# EasyEDA Pro project 主控板.eprj

# Schematic Schematic1

## Sheets
1 P1: Board Name: Board1; Create Date: 2025-03-21; Page Name: P1; Project Name: G431主控板 (2); Schematic Name: Schematic1; Update Date: 2025-07-14; Company: 嘉立创EDA; Page Size: A4; Version: V1.0
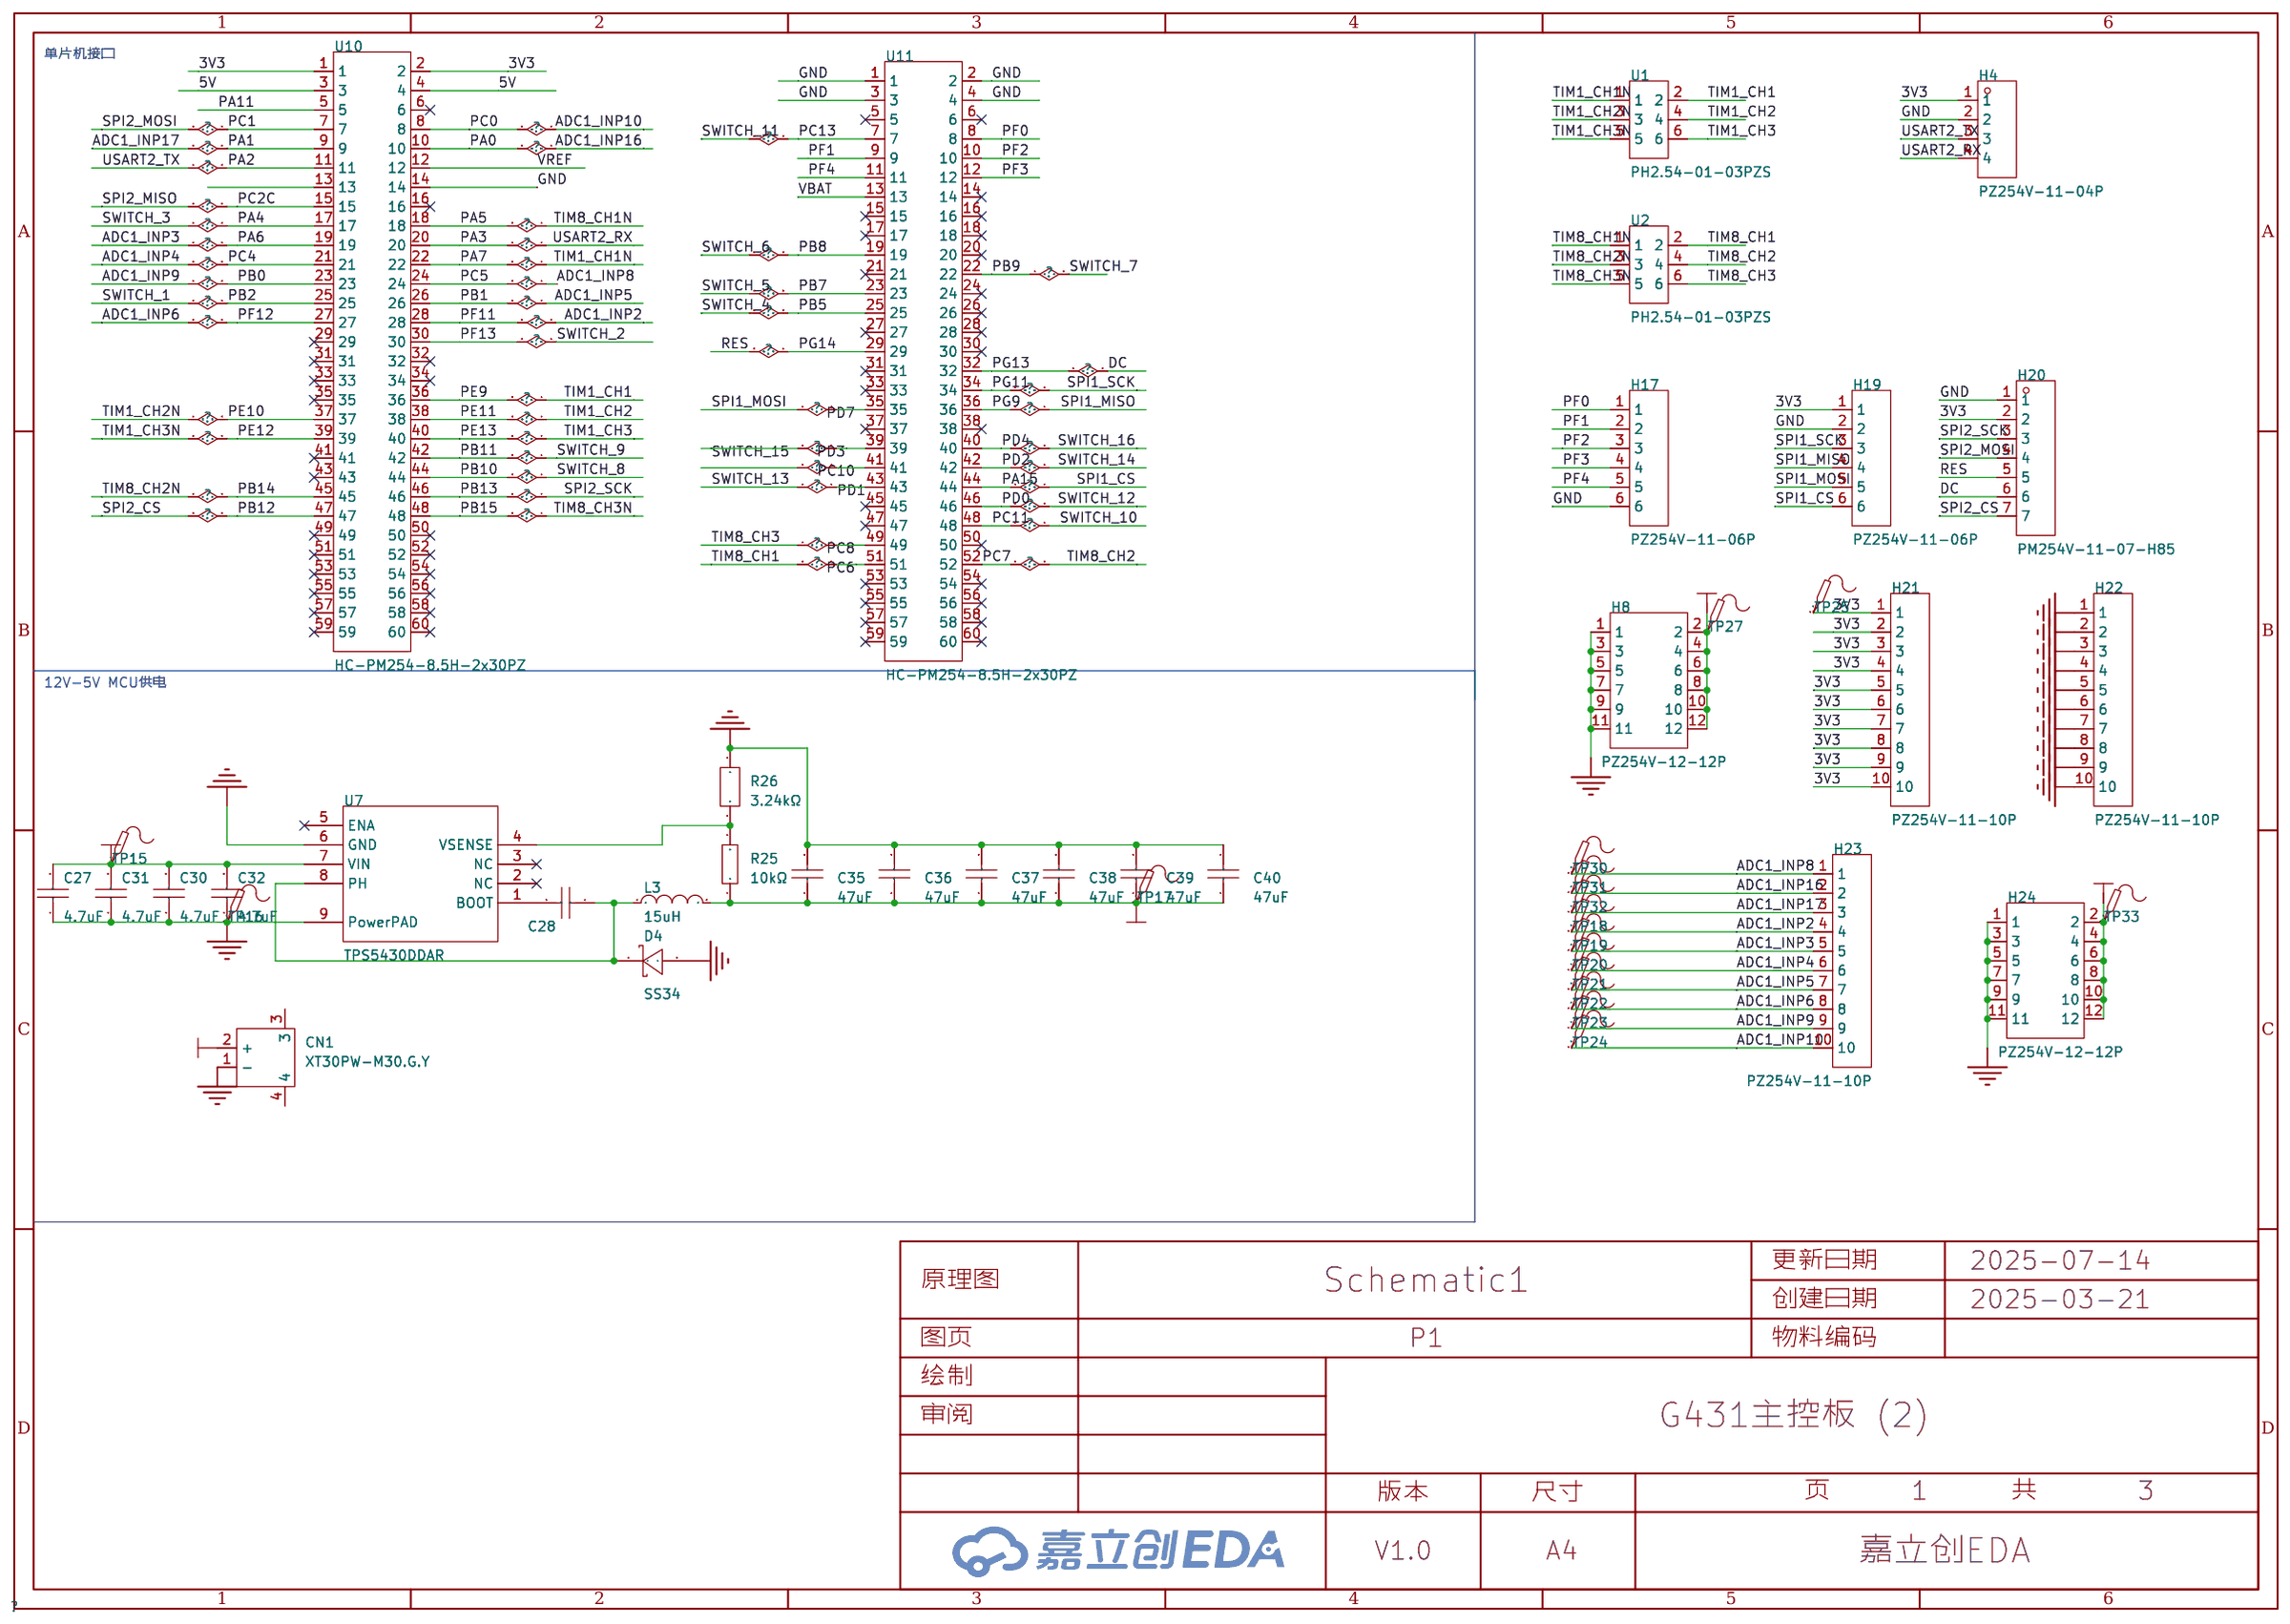
[diagram p0: P1]
2 P2: Create Date: 2025-05-21; Page Name: P2; Project Name: G431主控板; Update Date: 2025-05-21
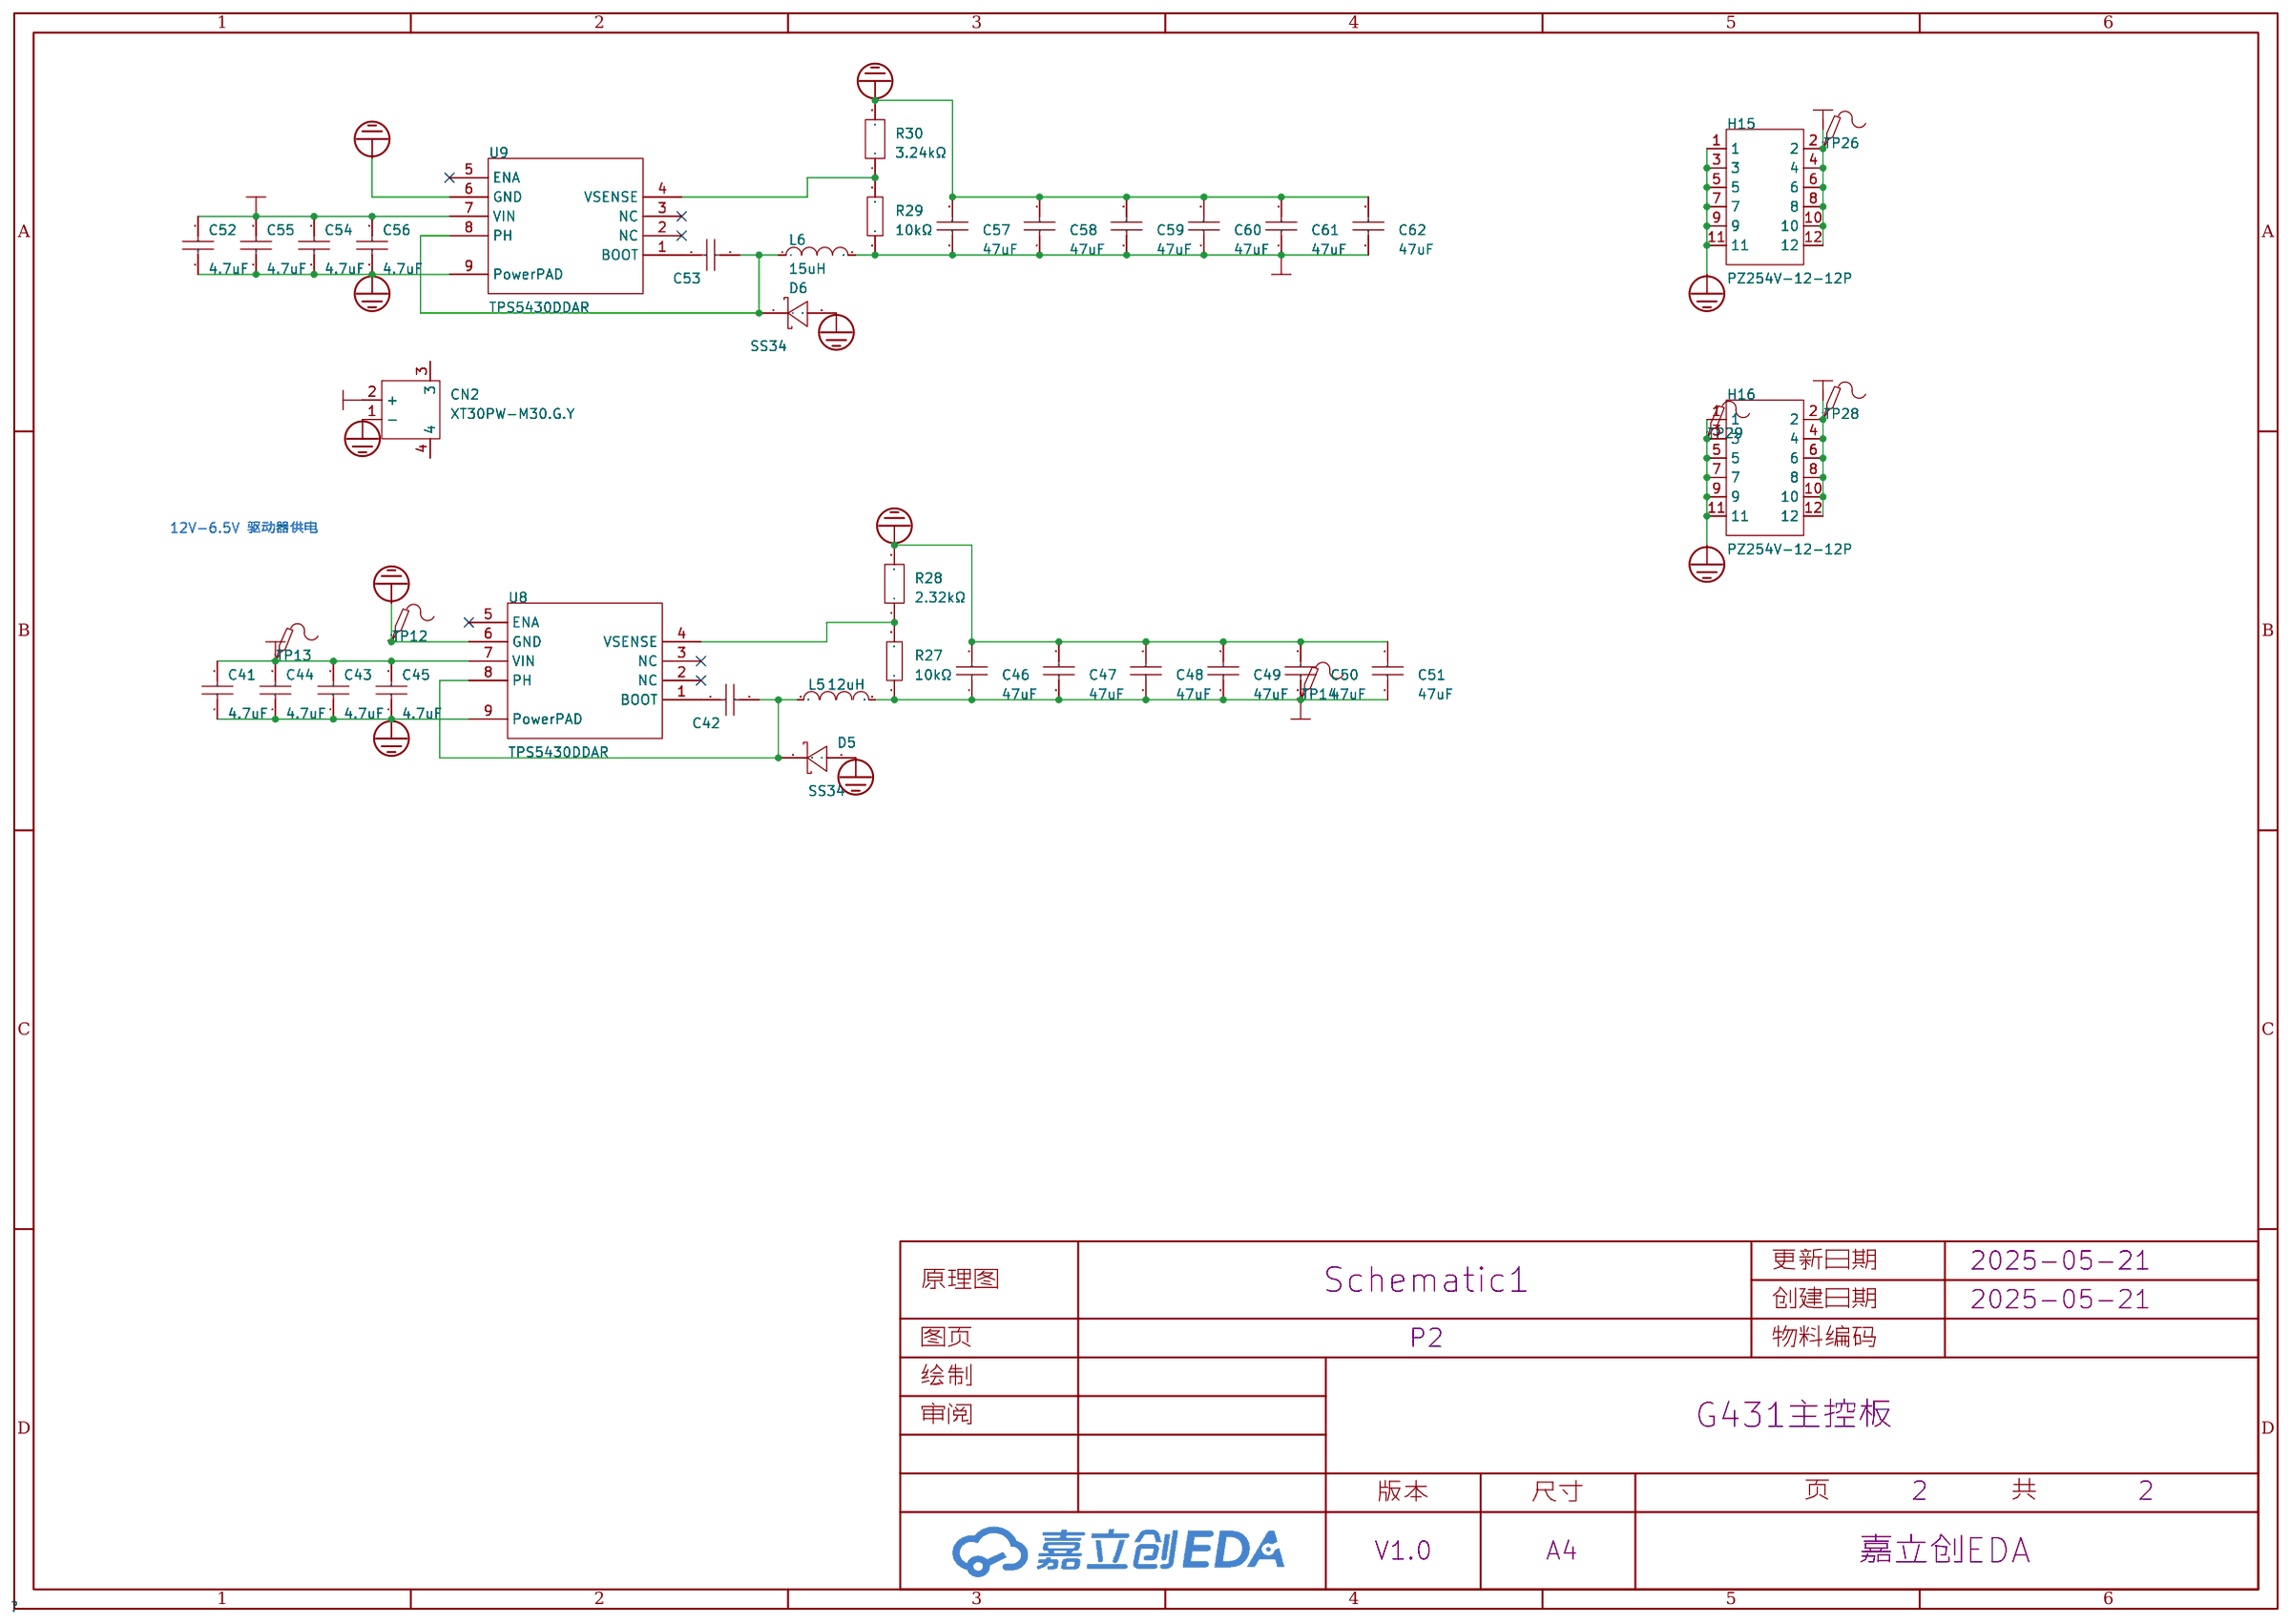
[diagram p1: P2]
3 P3: Create Date: 2025-06-02; Page Name: P3; Project Name: G431主控板; Update Date: 2025-06-02
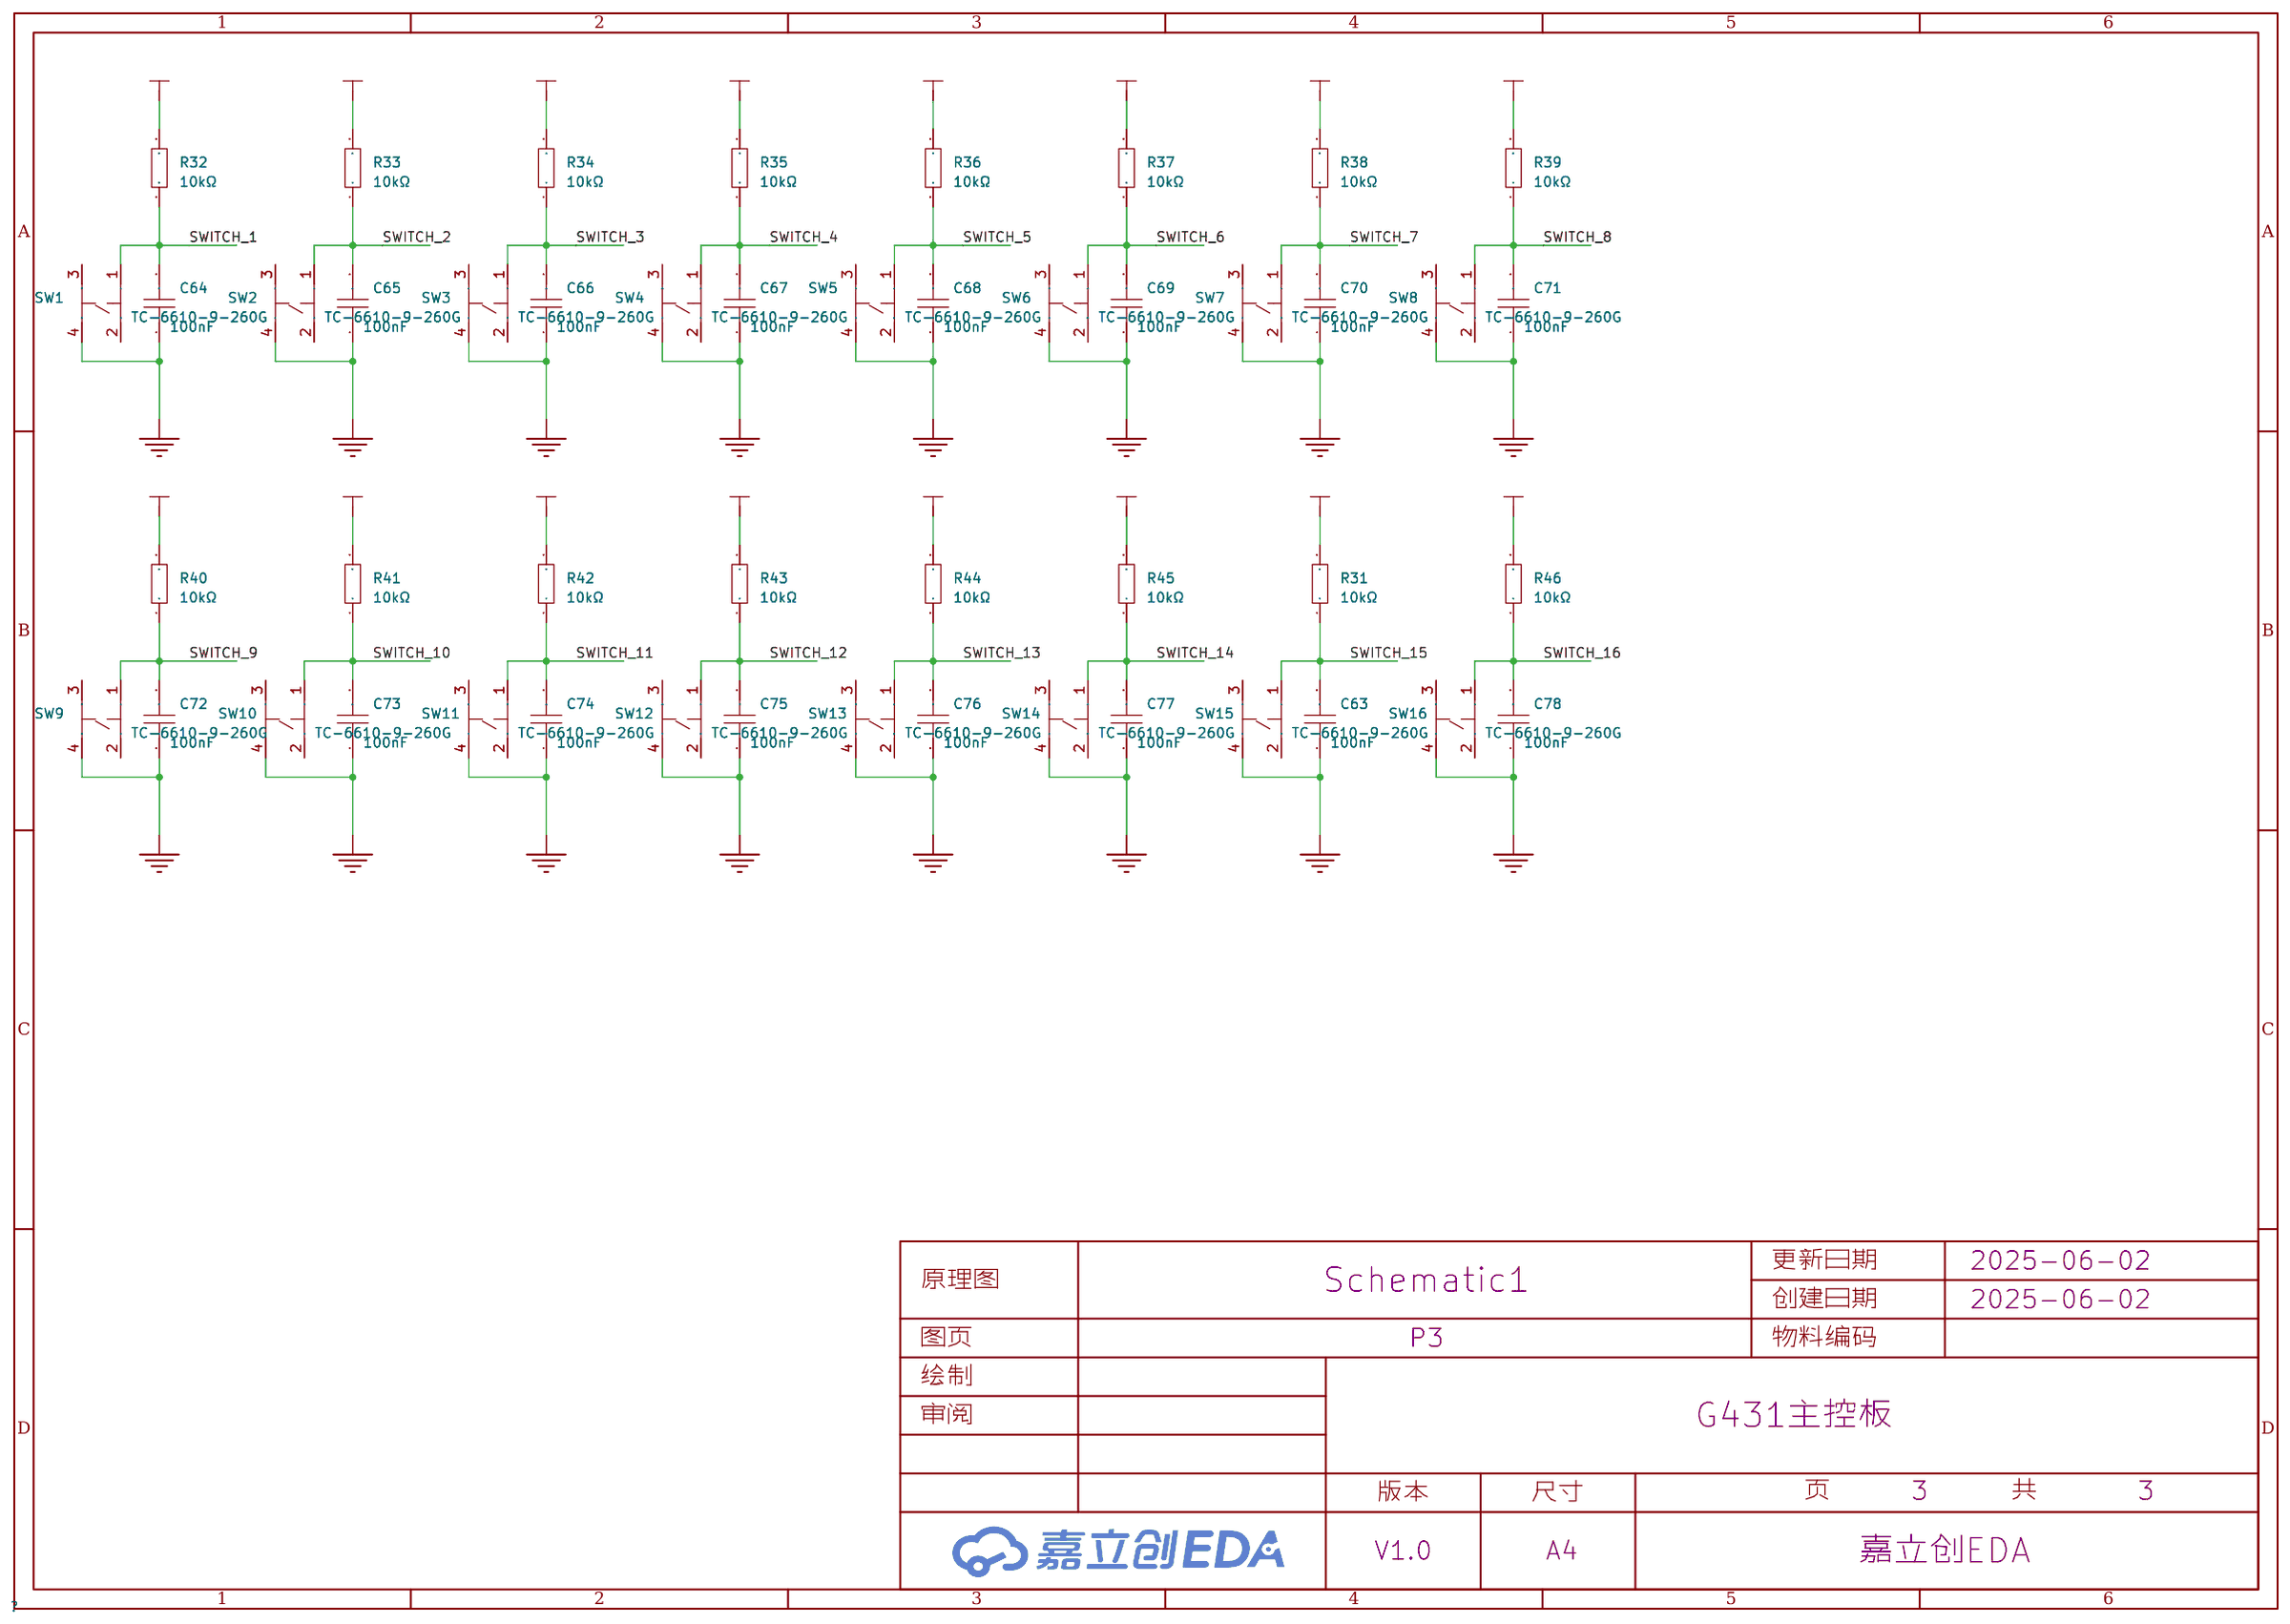
[diagram p2: P3]

## Parts
sheet P1
C27  4.7uF  [C0603]
C28  10nF  [C0603]
C30  4.7uF  [C0603]
C31  4.7uF  [C0603]
C32  4.7uF  [C0603]
C35  47uF  [C0805]
C36  47uF  [C0805]
C37  47uF  [C0805]
C38  47uF  [C0805]
C39  47uF  [C0805]
C40  47uF  [C0805]
CN1  XT30PW-M30.G.Y  [CONN-TH_XT30PW-M]
D4  SS34  [SMA_L4.3-W2.6-LS5.2-RD]
H4  PZ254V-11-04P  [HDR-TH_4P-P2.54-V-M]
H8  PZ254V-12-12P  [HDR-TH_12P-P2.54-V-M-R2-C6-S2.54]
H17  PZ254V-11-06P  [HDR-TH_6P-P2.54-V-M]
H19  PZ254V-11-06P  [HDR-TH_6P-P2.54-V-M]
H20  PM254V-11-07-H85  [HDR-TH_7P-P2.54-V-F]
H21  PZ254V-11-10P  [HDR-TH_10P-P2.54-V-M]
H22  PZ254V-11-10P  [HDR-TH_10P-P2.54-V-M]
H23  PZ254V-11-10P  [HDR-TH_10P-P2.54-V-M]
H24  PZ254V-12-12P  [HDR-TH_12P-P2.54-V-M-R2-C6-S2.54]
L3  15uH  [IND-SMD_L5.2-W5.2_YSPI0530]
R25  10kΩ  [R0603]
R26  3.24kΩ  [R0603]
TP15  -  [Test-Point-0.5mm]
TP16  -  [Test-Point-0.5mm]
TP17  -  [Test-Point-0.5mm]
TP18  -  [Test-Point-0.5mm]
TP19  -  [Test-Point-0.5mm]
TP20  -  [Test-Point-0.5mm]
TP21  -  [Test-Point-0.5mm]
TP22  -  [Test-Point-0.5mm]
TP23  -  [Test-Point-0.5mm]
TP24  -  [Test-Point-0.5mm]
TP25  -  [Test-Point-0.5mm]
TP27  -  [Test-Point-0.5mm]
TP30  -  [Test-Point-0.5mm]
TP31  -  [Test-Point-0.5mm]
TP32  -  [Test-Point-0.5mm]
TP33  -  [Test-Point-0.5mm]
U1  PH2.54-01-03PZS  [HDR-TH_6P-P2.54-V-M-R2-C3-S2.54]
U2  PH2.54-01-03PZS  [HDR-TH_6P-P2.54-V-M-R2-C3-S2.54]
U7  TPS5430DDAR  [ESOP-8_L4.9-W3.9-P1.27-LS6.0-TL-EP]
U10  HC-PM254-8.5H-2x30PZ  [HDR-TH_60P-P2.54-V-F-R2-C30-S2.54]
U11  HC-PM254-8.5H-2x30PZ  [HDR-TH_60P-P2.54-V-F-R2-C30-S2.54]
sheet P2
C41  4.7uF  [C0603]
C42  10nF  [C0603]
C43  4.7uF  [C0603]
C44  4.7uF  [C0603]
C45  4.7uF  [C0603]
C46  47uF  [C0805]
C47  47uF  [C0805]
C48  47uF  [C0805]
C49  47uF  [C0805]
C50  47uF  [C0805]
C51  47uF  [C0805]
C52  4.7uF  [C0603]
C53  10nF  [C0603]
C54  4.7uF  [C0603]
C55  4.7uF  [C0603]
C56  4.7uF  [C0603]
C57  47uF  [C0805]
C58  47uF  [C0805]
C59  47uF  [C0805]
C60  47uF  [C0805]
C61  47uF  [C0805]
C62  47uF  [C0805]
CN2  XT30PW-M30.G.Y  [CONN-TH_XT30PW-M]
D5  SS34  [SMA_L4.3-W2.6-LS5.2-RD]
D6  SS34  [SMA_L4.3-W2.6-LS5.2-RD]
H15  PZ254V-12-12P  [HDR-TH_12P-P2.54-V-M-R2-C6-S2.54]
H16  PZ254V-12-12P  [HDR-TH_12P-P2.54-V-M-R2-C6-S2.54]
L5  12uH  [IND-SMD_L4.0-W4.0]
L6  15uH  [IND-SMD_L5.2-W5.2_YSPI0530]
R27  10kΩ  [R0603]
R28  2.32kΩ  [R0603]
R29  10kΩ  [R0603]
R30  3.24kΩ  [R0603]
TP12  -  [Test-Point-0.5mm]
TP13  -  [Test-Point-0.5mm]
TP14  -  [Test-Point-0.5mm]
TP26  -  [Test-Point-0.5mm]
TP28  -  [Test-Point-0.5mm]
TP29  -  [Test-Point-0.5mm]
U8  TPS5430DDAR  [ESOP-8_L4.9-W3.9-P1.27-LS6.0-TL-EP]
U9  TPS5430DDAR  [ESOP-8_L4.9-W3.9-P1.27-LS6.0-TL-EP]
sheet P3
C63  100nF  [C0603]
C64  100nF  [C0603]
C65  100nF  [C0603]
C66  100nF  [C0603]
C67  100nF  [C0603]
C68  100nF  [C0603]
C69  100nF  [C0603]
C70  100nF  [C0603]
C71  100nF  [C0603]
C72  100nF  [C0603]
C73  100nF  [C0603]
C74  100nF  [C0603]
C75  100nF  [C0603]
C76  100nF  [C0603]
C77  100nF  [C0603]
C78  100nF  [C0603]
R31  10kΩ  [R0603]
R32  10kΩ  [R0603]
R33  10kΩ  [R0603]
R34  10kΩ  [R0603]
R35  10kΩ  [R0603]
R36  10kΩ  [R0603]
R37  10kΩ  [R0603]
R38  10kΩ  [R0603]
R39  10kΩ  [R0603]
R40  10kΩ  [R0603]
R41  10kΩ  [R0603]
R42  10kΩ  [R0603]
R43  10kΩ  [R0603]
R44  10kΩ  [R0603]
R45  10kΩ  [R0603]
R46  10kΩ  [R0603]
SW1  TC-6610-9-260G  [SW-TH_4P-L5.0-W5.0-P4.50-LS6.5]
SW2  TC-6610-9-260G  [SW-TH_4P-L5.0-W5.0-P4.50-LS6.5]
SW3  TC-6610-9-260G  [SW-TH_4P-L5.0-W5.0-P4.50-LS6.5]
SW4  TC-6610-9-260G  [SW-TH_4P-L5.0-W5.0-P4.50-LS6.5]
SW5  TC-6610-9-260G  [SW-TH_4P-L5.0-W5.0-P4.50-LS6.5]
SW6  TC-6610-9-260G  [SW-TH_4P-L5.0-W5.0-P4.50-LS6.5]
SW7  TC-6610-9-260G  [SW-TH_4P-L5.0-W5.0-P4.50-LS6.5]
SW8  TC-6610-9-260G  [SW-TH_4P-L5.0-W5.0-P4.50-LS6.5]
SW9  TC-6610-9-260G  [SW-TH_4P-L5.0-W5.0-P4.50-LS6.5]
SW10  TC-6610-9-260G  [SW-TH_4P-L5.0-W5.0-P4.50-LS6.5]
SW11  TC-6610-9-260G  [SW-TH_4P-L5.0-W5.0-P4.50-LS6.5]
SW12  TC-6610-9-260G  [SW-TH_4P-L5.0-W5.0-P4.50-LS6.5]
SW13  TC-6610-9-260G  [SW-TH_4P-L5.0-W5.0-P4.50-LS6.5]
SW14  TC-6610-9-260G  [SW-TH_4P-L5.0-W5.0-P4.50-LS6.5]
SW15  TC-6610-9-260G  [SW-TH_4P-L5.0-W5.0-P4.50-LS6.5]
SW16  TC-6610-9-260G  [SW-TH_4P-L5.0-W5.0-P4.50-LS6.5]

## Library data of the parts
C27 C30-C32 C41 C43-C45 C52 C54-C56 = CL10A475KP8NNNC: 容值:4.7uF;精度:±10%;额定电压:10V;材质(温度系数):X5R;; LCSC Part Name: 4.7uF ±10% 10V; Supplier Part: C1705; Manufacturer: SAMSUNG(三星); Supplier Footprint: 0603; JLCPCB Part Class: 扩展库; Datasheet: https://atta.szlcsc.com/upload/public/pdf/source/20160218/1457707763339.pdf; Supplier: LCSC; Tolerance: ±10%; Voltage Rated: 10V; Temperature Coefficient: X5R
C28 C42 C53 = CC0603KRX7R9BB103: LCSC Part Name: 10nF ±10% 50V; Supplier Part: C100042; Manufacturer: YAGEO(国巨); Supplier Footprint: 0603; JLCPCB Part Class: 扩展库; Datasheet: https://atta.szlcsc.com/upload/public/pdf/source/20181008/C309510_22F155564471FAF6A489F7D68F34234E.pdf; Supplier: LCSC; Tolerance: ±10%; Voltage Rated: 50V; Temperature Coefficient: X7R
C35-C40 C46-C51 C57-C62 = CL21A476MQYNNNE: 容值:47uF;精度:±20%;额定电压:6.3V;材质(温度系数):X5R;; LCSC Part Name: 47uF ±20% 6.3V; Supplier Part: C16780; Manufacturer: SAMSUNG(三星); Supplier Footprint: 0805; JLCPCB Part Class: 基础库; Datasheet: https://atta.szlcsc.com/upload/public/pdf/source/20160218/1457707763339.pdf; Supplier: LCSC; Tolerance: ±20%; Voltage Rated: 6.3V; Temperature Coefficient: X5R
CN1 CN2 = XT30PW-M30.G.Y: LCSC Part Name: AMASS(艾迈斯)航模插头 卧式弯脚 XT30PW-M公头; Supplier Part: C431092; Manufacturer: AMASS(艾迈斯); JLCPCB Part Class: 扩展库; Datasheet: https://atta.szlcsc.com/upload/public/pdf/source/20220222/6A9F22F7850E25B33E1BE430ADF8560B.pdf; Supplier: LCSC; Type: 航模插头; RatedVoltage: DC 500V; InterfaceType: 公头; RatedCurrent: 15A; RecommendedWireGauge: 16/18/20AWG; contact resistance: 1.2mΩ; specifications: 2pin
D4-D6 = SS34_C8678: 二极管配置:独立式;正向压降(Vf):550mV@3A;直流反向耐压(Vr):40V;平均整流电流(Io):3A;; LCSC Part Name: 电压:40V 电流:3A; Supplier Part: C8678; Manufacturer: MDD; Supplier Footprint: SMA(DO-214AC); JLCPCB Part Class: 基础库; Datasheet: https://atta.szlcsc.com/upload/public/pdf/source/20230314/A80AE34493C69B89E2F4B1712F433538.pdf; Supplier: LCSC; Diode Configuration: 独立式; Forward Voltage (Vf@If): 550mV@3A; Reverse Voltage (Vr): 40V; Average Rectified Current (Io): 3A; Reverse Leakage Current (Ir): 500uA@40V
H4 = PZ254V-11-04P: LCSC Part Name: 间距:2.54mm 1x4P 直插 方针; Supplier Part: C2691448; Manufacturer: XFCN(兴飞); Supplier Footprint: 插件,P=2.54mm; JLCPCB Part Class: 扩展库; Datasheet: https://atta.szlcsc.com/upload/public/pdf/source/20200309/C492403_F9F19131791D08044AD4F84F8E751A34.pdf; Supplier: LCSC; Pin Structure: 1x4P; Pitch: 2.54mm; Circluar Pins/Square Pins: 方针; Mounting Type: 直插; Number of Rows: 单排; Number of Pins: 4P; Current Rating (Max): 3A; Voltage Rating (Max): 250V; Length of Mating Pin: 6mm; Insulation Height: 2.5mm; Length of End Connection Pin: 3mm; Operating Temperature Range: -40℃~+105℃; Color: 黑色
H8 H15 H16 H24 = PZ254V-12-12P: LCSC Part Name: 2x6P 间距:2.54mm 方针 直插; Supplier Part: C492423; Manufacturer: XFCN(兴飞); Supplier Footprint: 插件,P=2.54mm; JLCPCB Part Class: 扩展库; Datasheet: https://atta.szlcsc.com/upload/public/pdf/source/20200309/C492423_E4E2C9BC0EB9D59A2ABE4377D2E234B2.pdf; Supplier: LCSC; Pin Structure: 2x6P; Pitch: 2.54mm; Row Spacing: 2.54mm; Circluar Pins/Square Pins: 方针; Mounting Type: 直插; Number of Rows: 双排; Number of Pins: 12P; Length of Mating Pin: 6mm; Insulation Height: 2.5mm; Length of End Connection Pin: 3mm; Contact Material: 黄铜; Operating Temperature: -40℃~+105℃; Color: 黑色
H17 H19 = PZ254V-11-06P: LCSC Part Name: 1x6P 间距:2.54mm 方针 直插; Supplier Part: C492405; Manufacturer: XFCN(兴飞); Supplier Footprint: 插件,P=2.54mm; JLCPCB Part Class: 扩展库; Datasheet: https://atta.szlcsc.com/upload/public/pdf/source/20200309/C492405_597F1930F5B55CC3C7FD95458F1C3977.pdf; Supplier: LCSC; Pin Structure: 1x6P; Pitch: 2.54mm; Circluar Pins/Square Pins: 方针; Mounting Type: 直插; Number of Rows: 单排; Number of Pins: 6P; Length of Mating Pin: 6mm; Insulation Height: 2.5mm; Length of End Connection Pin: 3mm; Contact Material: 黄铜; Operating Temperature: -40℃~+105℃; Color: 黑色
H20 = PM254V-11-07-H85: LCSC Part Name: 间距:2.54mm 1x7P 直插; Supplier Part: C2832270; Manufacturer: XFCN(兴飞); Supplier Footprint: 插件,P=2.54mm; JLCPCB Part Class: 扩展库; Datasheet: https://atta.szlcsc.com/upload/public/pdf/source/20210514/C2832270_F424CC0071A81298BFB56B53406F9842.pdf; Supplier: LCSC; Holes Structure: 1x7P; Pitch: 2.54mm; Circular Hole / Square Hole: 方孔; Mounting Type: 直插; Number of Rows: 单排; Number of Holes: 7P; Current Rating (Max): 3A; Voltage Rating (Max): 250V; Holes Direction: 顶部; Operating Temperature Range: -40℃~+105℃
H21-H23 = PZ254V-11-10P: LCSC Part Name: 1x10P 间距:2.54mm 方针 直插; Supplier Part: C492409; Manufacturer: XFCN(兴飞); Supplier Footprint: 插件,P=2.54mm; JLCPCB Part Class: 扩展库; Datasheet: https://atta.szlcsc.com/upload/public/pdf/source/20200309/C492409_129C9431BDD62EBBBD0A643B6AAB9FBD.pdf; Supplier: LCSC; Pin Structure: 1x10P; Pitch: 2.54mm; Circluar Pins/Square Pins: 方针; Mounting Type: 直插; Number of Rows: 单排; Number of Pins: 10P; Length of Mating Pin: 6mm; Insulation Height: 2.5mm; Length of End Connection Pin: 3mm; Contact Material: 黄铜; Operating Temperature: -40℃~+105℃; Color: 黑色
L3 L6 = YSPI0530-150M: 电感值:15uH;精度:±20%;额定电流:2.1A;; LCSC Part Name: 15uH ±20%; Supplier Part: C497861; Manufacturer: YJYCOIN(益嘉源); Supplier Footprint: SMD,5.4x5.2x3mm; JLCPCB Part Class: 扩展库; Datasheet: https://atta.szlcsc.com/upload/public/pdf/source/20200317/C497860_F2BFA4F4324DE880FC2D7AD862E4A32B.pdf; Supplier: LCSC; Tolerance: ±20%; Rated Current: 2.1A; DC Resistance (DCR): 190mΩ
R25 R27 R29 = RT0603BRD0710KL: 电阻类型:薄膜电阻;阻值:10kΩ;精度:±0.1%;功率:100mW;最大工作电压:75V;温度系数:±25ppm/℃;; LCSC Part Name: 薄膜电阻 10kΩ ±0.1% 100mW; Supplier Part: C95204; Manufacturer: YAGEO(国巨); Supplier Footprint: 0603; JLCPCB Part Class: 扩展库; Datasheet: https://atta.szlcsc.com/upload/public/pdf/source/20170217/1487301593756.pdf; Supplier: LCSC; Type: 薄膜电阻; Tolerance: ±0.1%; Power(Watts): 100mW; Overload Voltage (Max): 75V; Temperature Coefficient: ±25ppm/℃; Operating Temperature Range: -55℃~+155℃
R26 R30 = RT0603BRB073K24L: 电阻类型:薄膜电阻;阻值:3.24kΩ;精度:±0.1%;功率:100mW;温度系数:±10ppm/℃;; LCSC Part Name: 薄膜电阻 3.24kΩ ±0.1% 100mW; Supplier Part: C860367; Manufacturer: YAGEO(国巨); Supplier Footprint: 0603; JLCPCB Part Class: 扩展库; Datasheet: https://atta.szlcsc.com/upload/public/pdf/source/20200610/C326738_5639A9F1B6EB6E4AE2197577D3456E7F.pdf; Supplier: LCSC; Type: 薄膜电阻; Tolerance: ±0.1%; Power(Watts): 100mW; Temperature Coefficient: ±10ppm/℃; Operating Temperature Range: -55℃~+155℃
TP12-TP33 = Test-Point
U1 U2 = PH2.54-01-03PZS: LCSC Part Name: 2x3P 间距:2.54mm 方针 直插; Supplier Part: C7501594; Manufacturer: XUNPU(讯普); Supplier Footprint: 插件,P=2.54mm; JLCPCB Part Class: 扩展库; Datasheet: https://atta.szlcsc.com/upload/public/pdf/source/20241122/C6659771919859911C7FDF3F9F3812CF.pdf; Supplier: LCSC; Pin Structure: 2x3P; Pitch: 2.54mm; Circluar Pins/Square Pins: 方针; Mounting Type: 直插; Number of Rows: 双排; Number of Pins: 6P; Length of Mating Pin: 6mm; Insulation Height: 2.5mm; Length of End Connection Pin: 3mm; Contact Material: 黄铜; Operating Temperature: -40℃~+105℃; Color: 黑色
U7-U9 = TPS5430DDAR: LCSC Part Name: 宽输入范围、3A输出电流的降压转换器; Supplier Part: C9864; Manufacturer: TI(德州仪器); Supplier Footprint: SOIC-8-EP; JLCPCB Part Class: 基础库; Datasheet: https://www.ti.com/cn/lit/gpn/tps5430; Supplier: LCSC; Function: 降压型; Output Type: 可调; Input Voltage: 5.5V~36V; Output Voltage: 1.221V~32.04V; Output Current: 3A; Switching Frequency: 500kHz; Operating Temperature: -40℃~+125℃@(TJ); Synchronous Rectification: 否; Number of Outputs: 1; Topology: 降压式; Switch tube (built-in/external): 内置; Output Current (Max): 3A
U10 U11 = HC-PM254-8.5H-2x30PZ: 插孔结构:2x30P;间距:2.54mm;行距:2.54mm;圆孔/方孔:方孔;安装方式:直插;排数:双排;总孔位数:60P;额定电流:3A;额定电压:-;插孔方向:顶部;塑高:8.5mm;触头材质:黄铜;触头镀层:金;工作温度:-40℃~+105℃;; LCSC Part Name: 间距2.54mm 2x30Pin 直插 PC3.0 H8.5; Supplier Part: C41376170; Manufacturer: HC(虹成电子); Supplier Footprint: 插件,P=2.54mm; JLCPCB Part Class: Extended Part; Datasheet: https://atta.szlcsc.com/upload/public/pdf/source/20250106/E630F0C183C59BEB7B3B7BE6D3132464.pdf; Supplier: LCSC; Holes Structure: 2x30P; Pitch: 2.54mm; Row Spacing: 2.54mm; Circular Hole / Square Hole: 方孔; Mounting Type: 直插; Number of Rows: 双排; Number of Positions: 60P; Current Rating: 3A; Holes Direction: 顶部; Insulation Height: 8.5mm; Contact Material: 黄铜; Contact Plating: 金; Operating Temperature: -40℃~+105℃; PIN Length: 3mm
L5 = YNR4012-120M: LCSC Part Name: 12uH ±20%; Supplier Part: C497783; Manufacturer: YJYCOIN(益嘉源); Supplier Footprint: SMD,4x4x1.2mm; JLCPCB Part Class: 扩展库; Datasheet: https://atta.szlcsc.com/upload/public/pdf/source/20200317/C497775_B97ACFD3F1553E2A8E8AA921B9B778DC.pdf; Supplier: LCSC; Tolerance: ±20%; Rated Current: 660mA; DC Resistance (DCR): 290mΩ
R28 = RT0603BRD072K32L: LCSC Part Name: 薄膜电阻 2.32kΩ ±0.1% 100mW; Supplier Part: C861296; Manufacturer: YAGEO(国巨); Supplier Footprint: 0603; JLCPCB Part Class: 扩展库; Datasheet: https://atta.szlcsc.com/upload/public/pdf/source/20200610/C326738_5639A9F1B6EB6E4AE2197577D3456E7F.pdf; Supplier: LCSC; Type: 薄膜电阻; Tolerance: ±0.1%; Power(Watts): 100mW; Temperature Coefficient: ±25ppm/℃; Operating Temperature: -55℃~+155℃
C63-C78 = FCC0603B104K500CT: LCSC Part Name: 100nF ±10% 50V; Supplier Part: C5137636; Manufacturer: FOJAN(富捷); Supplier Footprint: 0603; JLCPCB Part Class: 扩展库; Datasheet: https://atta.szlcsc.com/upload/public/pdf/source/20220818/0EB3B7FB2F5648AC16609637FBA7DABE.pdf; Supplier: LCSC; Tolerance: ±10%; Voltage Rating: 50V; Temperature Coefficient: X7R
R31-R46 = 0603WAF1002T5E: LCSC Part Name: 厚膜电阻 10kΩ ±1% 100mW; Supplier Part: C25804; Manufacturer: UNI-ROYAL(厚声); Supplier Footprint: 0603; JLCPCB Part Class: 基础库; Datasheet: https://atta.szlcsc.com/upload/public/pdf/source/20200306/C422600_1E6D84923E4A46A82E41ADD87F860B5C.pdf; Supplier: LCSC; Type: 厚膜电阻; Tolerance: ±1%; Power(Watts): 100mW; Overload Voltage (Max): 75V; Temperature Coefficient: ±100ppm/℃; Operating Temperature Range: -55℃~+155℃
SW1-SW16 = TC-6610-9-260G: LCSC Part Name: 6*6*9mm 插件 轻触开关; Supplier Part: C2845257; Manufacturer: HCTL(华灿天禄); Supplier Footprint: 插件; JLCPCB Part Class: 扩展库; Datasheet: https://atta.szlcsc.com/upload/public/pdf/source/20230323/2FDB5D6FCE87B7593CD3E5FAC75F65D7.pdf; Supplier: LCSC; Circuit: 单刀单掷; Actuator Style: 圆形按钮; Operating Force: 2.6N; Mounting Type: 直插; Length: 6mm; Width: 6mm; Switch Height: 9mm; Strike Gundam: 不带支架; Contact Current: 50mA; Voltage Rating: 12V; Actuator/Cap Color: 黑色; With Lamp: 无; Termination Style: PC引脚; Life: 10万次; Operating Temperature: -25℃~+85℃

## Nets
3V3: H4.1 H19.1 H20.2 H21.1 H21.2 H21.3 H21.4 H21.5 H21.6 H21.7 H21.8 H21.9 H21.10 R31.2 R32.2 R33.2 R34.2 R35.2 R36.2 R37.2 R38.2 R39.2 R40.2 R41.2 R42.2 R43.2 R44.2 R45.2 R46.2 TP25.1 U10.1 U10.2
5V: C35.1 C36.1 C37.1 C38.1 C39.1 C40.1 H8.2 H8.4 H8.6 H8.8 H8.10 H8.12 H24.2 H24.4 H24.6 H24.8 H24.10 H24.12 L3.2 R25.1 TP17.1 TP27.1 TP33.1 U10.3 U10.4
5V_SAMPLE: C57.1 C58.1 C59.1 C60.1 C61.1 C62.1 H16.2 H16.4 H16.6 H16.8 H16.10 H16.12 L6.2 R29.1 TP28.1
6.5V: C46.1 C47.1 C48.1 C49.1 C50.1 C51.1 H15.2 H15.4 H15.6 H15.8 H15.10 H15.12 L5.2 R27.1 TP14.1 TP26.1
12V: C27.2 C30.2 C31.2 C32.2 CN1.2(+) TP15.1 U7.7(VIN)
12V_SAMPLE: C41.2 C43.2 C44.2 C45.2 C52.2 C54.2 C55.2 C56.2 CN2.2(+) TP13.1 U8.7(VIN) U9.7(VIN)
GND: C27.1 C30.1 C31.1 C32.1 C35.2 C36.2 C37.2 C38.2 C39.2 C40.2 C63.1 C64.1 C65.1 C66.1 C67.1 C68.1 C69.1 C70.1 C71.1 C72.1 C73.1 C74.1 C75.1 C76.1 C77.1 C78.1 CN1.1(-) D4.2(A) H4.2 H8.1 H8.3 H8.5 H8.7 H8.9 H8.11 H17.6 H19.2 H20.1 H22.1 H22.2 H22.3 H22.4 H22.5 H22.6 H22.7 H22.8 H22.9 H22.10 H24.1 H24.3 H24.5 H24.7 H24.9 H24.11 R26.2 SW1.4 SW2.4 SW3.4 SW4.4 SW5.4 SW6.4 SW7.4 SW8.4 SW9.4 SW10.4 SW11.4 SW12.4 SW13.4 SW14.4 SW15.4 SW16.4 TP16.1 U7.6(GND) U7.9(PowerPAD) U10.14 U11.1 U11.2 U11.3 U11.4
PGND: C41.1 C43.1 C44.1 C45.1 C46.2 C47.2 C48.2 C49.2 C50.2 C51.2 C52.1 C54.1 C55.1 C56.1 C57.2 C58.2 C59.2 C60.2 C61.2 C62.2 CN2.1(-) D5.2(A) D6.2(A) H15.1 H15.3 H15.5 H15.7 H15.9 H15.11 H16.1 H16.3 H16.5 H16.7 H16.9 H16.11 R28.2 R30.2 TP12.1 TP29.1 U8.6(GND) U8.9(PowerPAD) U9.6(GND) U9.9(PowerPAD)
VBAT: U11.13
ADC1_INP2: H23.4 TP18.1 U10.28
ADC1_INP3: H23.5 TP19.1 U10.19
ADC1_INP4: H23.6 TP20.1 U10.21
ADC1_INP5: H23.7 TP21.1 U10.26
ADC1_INP6: H23.8 TP22.1 U10.27
ADC1_INP8: H23.1 TP30.1 U10.24
ADC1_INP9: H23.9 TP23.1 U10.23
ADC1_INP10: H23.10 TP24.1 U10.8
ADC1_INP16: H23.2 TP31.1 U10.10
ADC1_INP17: H23.3 TP32.1 U10.9
DC: H20.6 U11.32
PA2: H4.3 U10.11
PA3: H4.4 U10.20
PA4: C66.2 R34.1 SW3.1 U10.17
PA5: U2.1 U10.18
PA7: U1.1 U10.22
PA11: U10.5
PA15: H19.6 U11.44
PB2: C64.2 R32.1 SW1.1 U10.25
PB5: C67.2 R35.1 SW4.1 U11.25
PB7: C68.2 R36.1 SW5.1 U11.23
PB8: C69.2 R37.1 SW6.1 U11.19
PB9: C70.2 R38.1 SW7.1 U11.22
PB10: C71.2 R39.1 SW8.1 U10.44
PB11: C72.2 R40.1 SW9.1 U10.42
PB12: H20.7 U10.47
PB13: H20.3 U10.46
PB14: U2.3 U10.45
PB15: U2.5 U10.48
PC1: H20.4 U10.7
PC2C: U10.15
PC6: U2.2 U11.51
PC7: U2.4 U11.52
PC8: U2.6 U11.49
PC10: U11.41
PC11: C73.2 R41.1 SW10.1 U11.48
PC13: C74.2 R42.1 SW11.1 U11.7
PD0: C75.2 R43.1 SW12.1 U11.46
PD1: C76.2 R44.1 SW13.1 U11.43
PD2: C77.2 R45.1 SW14.1 U11.42
PD3: C63.2 R31.1 SW15.1 U11.39
PD4: C78.2 R46.1 SW16.1 U11.40
PD7: H19.5 U11.35
PE9: U1.2 U10.36
PE10: U1.3 U10.37
PE11: U1.4 U10.38
PE12: U1.5 U10.39
PE13: U1.6 U10.40
PF0: H17.1 U11.8
PF1: H17.2 U11.9
PF2: H17.3 U11.10
PF3: H17.4 U11.12
PF4: H17.5 U11.11
PF13: C65.2 R33.1 SW2.1 U10.30
PG9: H19.4 U11.36
PG11: H19.3 U11.34
PG14: H20.5 U11.29
VREF: U10.12
$1N5567: C28.1 D4.1(K) L3.1 U7.8(PH)
$1N5568: C28.2 U7.1(BOOT)
$1N5569: R25.2 R26.1 U7.4(VSENSE)
$2N774: C53.2 U9.1(BOOT)
$2N775: C53.1 D6.1(K) L6.1 U9.8(PH)
$2N778: R29.2 R30.1 U9.4(VSENSE)
$2N2986: C42.1 D5.1(K) L5.1 U8.8(PH)
$2N2987: C42.2 U8.1(BOOT)
$2N2990: R27.2 R28.1 U8.4(VSENSE)

Not connected (* = marked no-connect by the designer): CN1 3 4; CN2 3 4; SW1 2 3; SW2 2 3; SW3 2 3; SW4 2 3; SW5 2 3; SW6 2 3; SW7 2 3; SW8 2 3; SW9 2 3; SW10 2 3; SW11 2 3; SW12 2 3; SW13 2 3; SW14 2 3; SW15 2 3; SW16 2 3; U7 2(NC)* 3(NC)* 5(ENA)*; U8 2(NC)* 3(NC)* 5(ENA)*; U9 2(NC)* 3(NC)* 5(ENA)*; U10 6* 13 16* 29* 31* 32* 33* 34* 35* 41* 43* 49* 50* 51* 52* 53* 54* 55* 56* 57* 58* 59* 60*; U11 5* 6* 14* 15* 16* 17* 18* 20* 21* 24* 26* 27* 28* 30* 31* 33* 37* 38* 45* 47* 50* 53* 54* 55* 56* 57* 58* 59* 60*

## Notes on the sheets
sheet 1
- 单片机接口
- 12V-5V MCU供电
sheet 2
- 12V-6.5V 驱动器供电

# Board PCB3
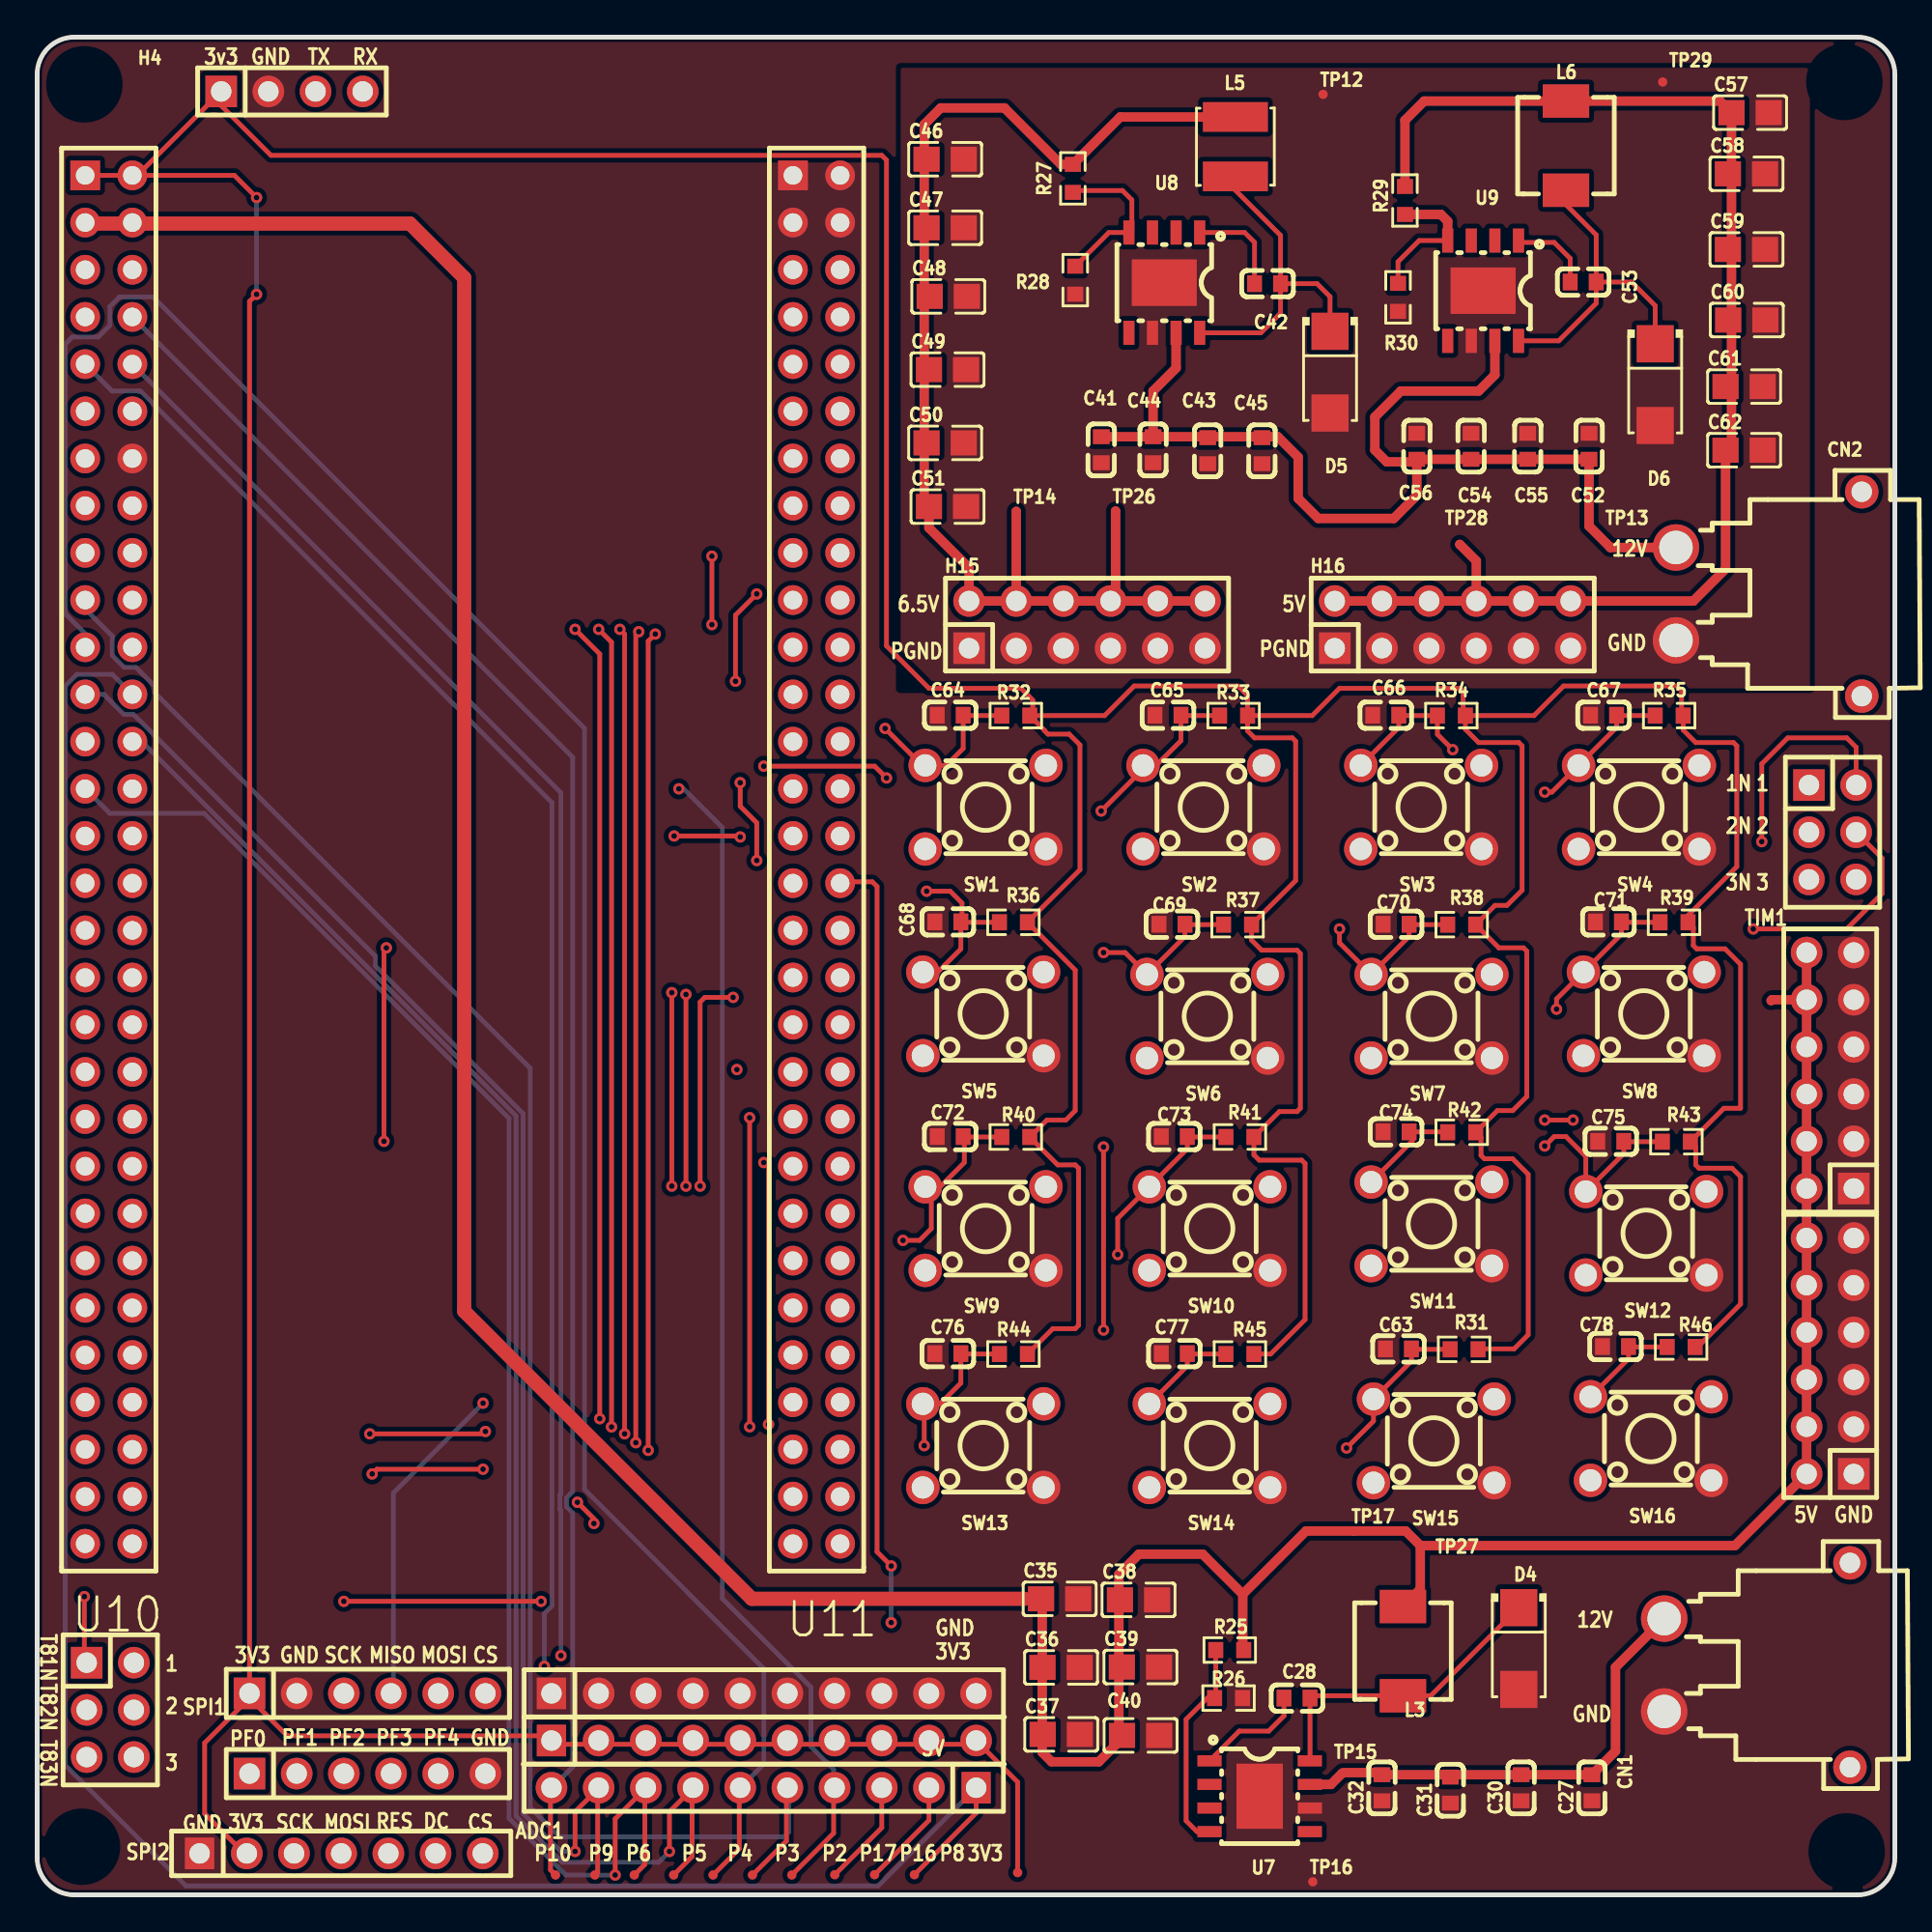
[diagram p3: board, top side]
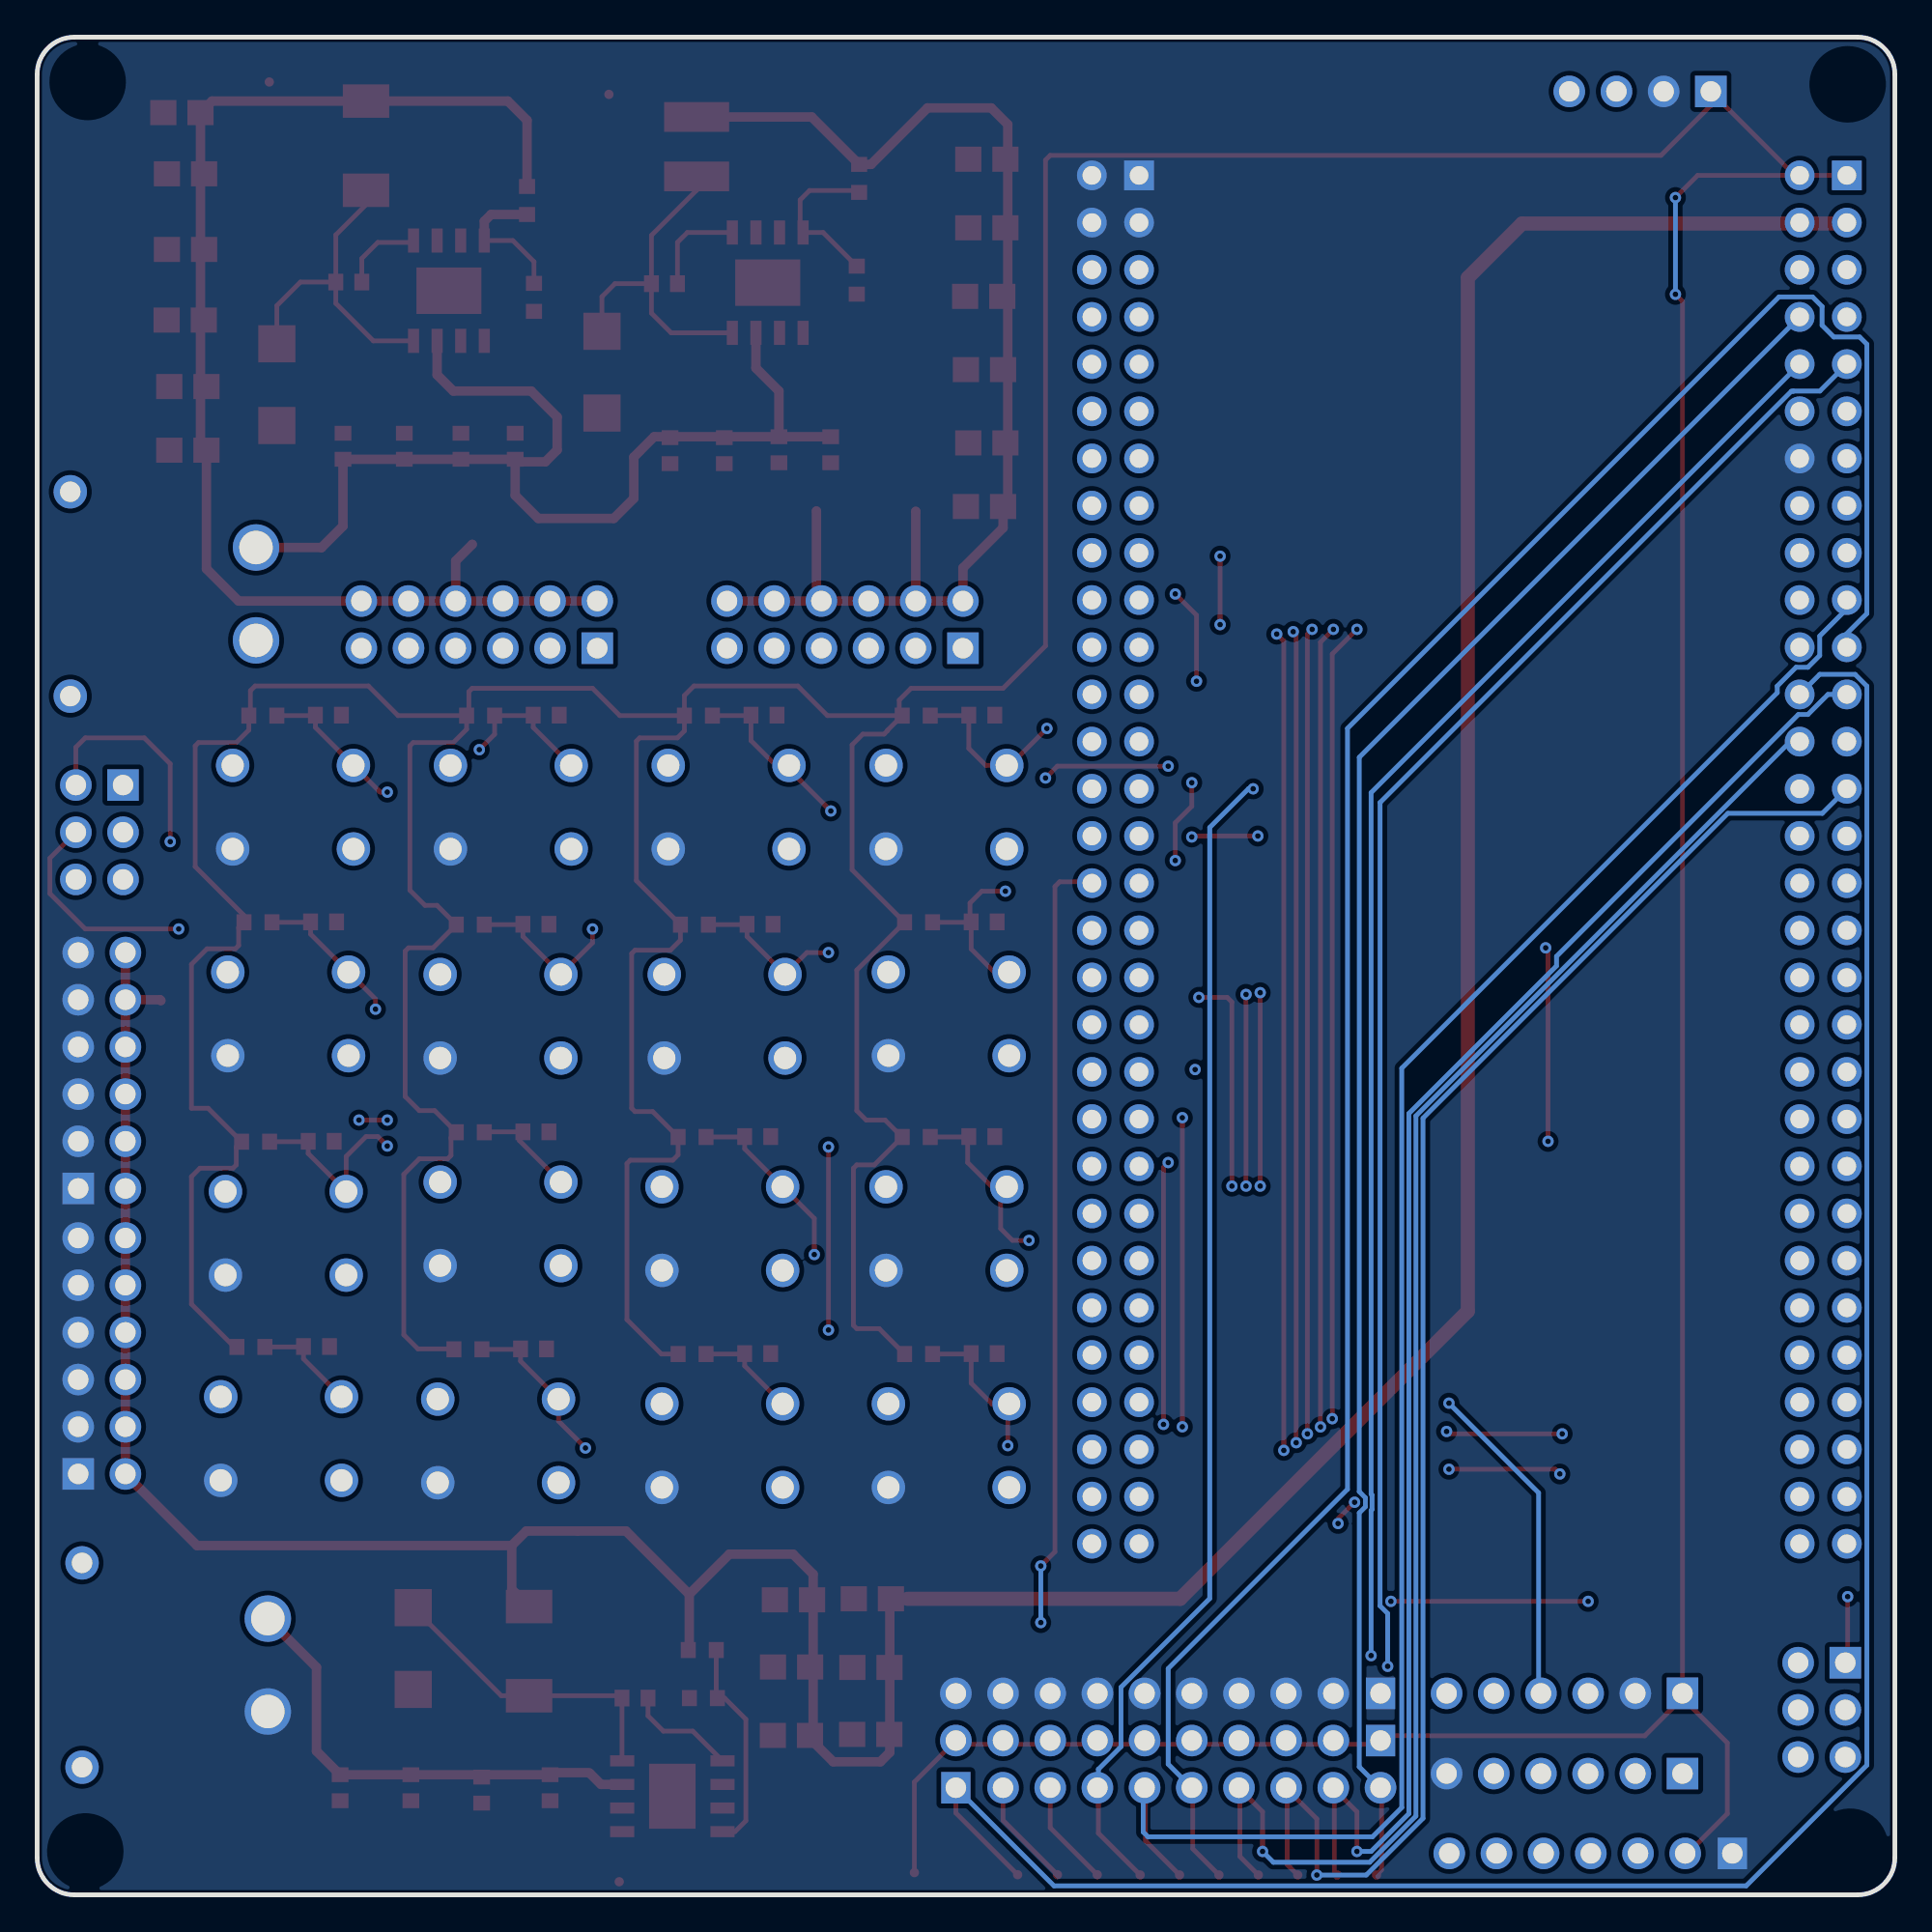
[diagram p4: board, bottom side, seen from below]

Outline 100 x 100 mm; copper layers: Top Layer, Inner1, Inner2, Bottom Layer. Coordinates in mm from the lower left corner of the outline.
Outline path: 0,98 0,2 arc(0.59,0.59) 2,0 98,0 arc(99.41,0.59) 100,2 100,98 arc(99.41,99.41) 98,100 2,100 arc(0.59,99.41) 0,98
Stack: Top Layer 0.035mm 外层铜厚1oz / Dielectric1 0.2104mm 7628 RC49% 8.6mil / Inner1 0.0152mm 内层铜厚 / Dielectric2 1.065mm 1.1mm H/HOZ Copper / Inner2 0.0152mm 内层铜厚 / Dielectric3 0.2104mm 7628 RC49% 8.6mil / Bottom Layer 0.035mm 外层铜厚1oz

## Design rules (mm)
template: 自定义配置
spacing copperThickness1oz (default): track to track 0.102, other pairs 0.152 to 0.3
spacing copperThickness2oz: track to track 0.203, other pairs 0.152 to 0.3
track width copperThickness1oz (default): min 0.127, default 0.254, max 2.54
track width copperThickness2oz: min 0.203, default 0.254, max 2.54
differential pair differentialPair (default): width min 0.127, default 0.254, max 2.54; gap min 0.152, default 0.152
via viaSize (default): diameter min 0.5, default 0.61, max 10; hole min 0.3, default 0.305, max 6.3

## Placement (name value [footprint] x y rotation side)
C27  4.7uF  [C0603]  83.69 5.77 90 top
C28  10nF  [C0603]  67.82 10.59 180 top
C30  4.7uF  [C0603]  79.88 5.77 90 top
C31  4.7uF  [C0603]  76.07 5.64 90 top
C32  4.7uF  [C0603]  72.39 5.77 90 top
C35  47uF  [C0805]  55.04 15.94 0 top
C36  47uF  [C0805]  55.12 12.24 0 top
C37  47uF  [C0805]  55.13 8.64 0 top
C38  47uF  [C0805]  59.29 15.88 0 top
C39  47uF  [C0805]  59.39 12.26 0 top
C40  47uF  [C0805]  59.4 8.58 0 top
C41  4.7uF  [C0603]  57.28 77.79 90 top
C42  10nF  [C0603]  66.23 86.73 180 top
C43  4.7uF  [C0603]  63.01 77.74 90 top
C44  4.7uF  [C0603]  60.07 77.79 90 top
C45  4.7uF  [C0603]  65.93 77.74 90 top
C46  47uF  [C0805]  48.88 93.43 0 top
C47  47uF  [C0805]  48.88 89.74 0 top
C48  47uF  [C0805]  49.05 86.05 0 top
C49  47uF  [C0805]  49.01 82.1 0 top
C50  47uF  [C0805]  48.88 78.16 0 top
C51  47uF  [C0805]  49.01 74.73 0 top
C52  4.7uF  [C0603]  74.27 77.98 270 top
C53  10nF  [C0603]  83.22 86.82 180 top
C54  4.7uF  [C0603]  80.24 77.98 270 top
C55  4.7uF  [C0603]  77.19 77.98 270 top
C56  4.7uF  [C0603]  83.54 77.98 270 top
C57  47uF  [C0805]  92.21 95.94 0 top
C58  47uF  [C0805]  92.01 92.64 0 top
C59  47uF  [C0805]  92.01 88.57 0 top
C60  47uF  [C0805]  92.03 84.77 0 top
C61  47uF  [C0805]  91.89 81.19 0 top
C62  47uF  [C0805]  91.89 77.77 0 top
C63  100nF  [C0603]  73.28 29.39 0 top
C64  100nF  [C0603]  49.15 63.5 0 top
C65  100nF  [C0603]  60.87 63.5 0 top
C66  100nF  [C0603]  72.6 63.5 0 top
C67  100nF  [C0603]  84.32 63.5 0 top
C68  100nF  [C0603]  49.02 52.38 0 top
C69  100nF  [C0603]  61.09 52.25 0 top
C70  100nF  [C0603]  73.15 52.25 0 top
C71  100nF  [C0603]  84.58 52.38 0 top
C72  100nF  [C0603]  49.15 40.82 0 top
C73  100nF  [C0603]  61.21 40.82 0 top
C74  100nF  [C0603]  73.15 41.07 0 top
C75  100nF  [C0603]  84.71 40.56 0 top
C76  100nF  [C0603]  49.02 29.13 0 top
C77  100nF  [C0603]  61.21 29.13 0 top
C78  100nF  [C0603]  84.96 29.52 0 top
CN1  XT30PW-M30.G.Y  [CONN-TH_XT30PW-M]  92.58 12.37 90 top
CN2  XT30PW-M30.G.Y  [CONN-TH_XT30PW-M]  93.22 70.03 90 top
D4  SS34  [SMA_L4.3-W2.6-LS5.2-RD]  79.76 13.26 270 top
D5  SS34  [SMA_L4.3-W2.6-LS5.2-RD]  69.6 81.97 270 top
D6  SS34  [SMA_L4.3-W2.6-LS5.2-RD]  87.1 81.29 270 top
H4  PZ254V-11-04P  [HDR-TH_4P-P2.54-V-M]  13.72 97.08 0 top
H8  PZ254V-12-12P  [HDR-TH_12P-P2.54-V-M-R2-C6-S2.54]  96.52 29.01 90 top
H15  PZ254V-12-12P  [HDR-TH_12P-P2.54-V-M-R2-C6-S2.54]  56.51 68.38 0 top
H16  PZ254V-12-12P  [HDR-TH_12P-P2.54-V-M-R2-C6-S2.54]  76.2 68.38 0 top
H17  PZ254V-11-06P  [HDR-TH_6P-P2.54-V-M]  17.78 6.53 0 top
H19  PZ254V-11-06P  [HDR-TH_6P-P2.54-V-M]  17.78 10.85 0 top
H20  PM254V-11-07-H85  [HDR-TH_7P-P2.54-V-F]  16.37 2.23 0 top
H21  PZ254V-11-10P  [HDR-TH_10P-P2.54-V-M]  39.12 8.31 0 top
H22  PZ254V-11-10P  [HDR-TH_10P-P2.54-V-M]  39.12 10.85 0 top
H23  PZ254V-11-10P  [HDR-TH_10P-P2.54-V-M]  39.12 5.77 180 top
H24  PZ254V-12-12P  [HDR-TH_12P-P2.54-V-M-R2-C6-S2.54]  96.52 44.37 90 top
L3  15uH  [IND-SMD_L5.2-W5.2_YSPI0530]  73.52 13.12 90 top
L5  12uH  [IND-SMD_L4.0-W4.0]  64.5 94.1 90 top
L6  15uH  [IND-SMD_L5.2-W5.2_YSPI0530]  82.3 94.16 90 top
R25  10kΩ  [R0603]  64.2 13.18 180 top
R26  3.24kΩ  [R0603]  64.13 10.59 0 top
R27  10kΩ  [R0603]  55.75 92.4 270 top
R28  2.32kΩ  [R0603]  55.88 86.92 270 top
R29  10kΩ  [R0603]  73.63 91.21 270 top
R30  3.24kΩ  [R0603]  73.26 85.99 270 top
R31  10kΩ  [R0603]  76.81 29.37 0 top
R32  10kΩ  [R0603]  52.68 63.48 0 top
R33  10kΩ  [R0603]  64.4 63.48 0 top
R34  10kΩ  [R0603]  76.13 63.48 0 top
R35  10kΩ  [R0603]  87.85 63.48 0 top
R36  10kΩ  [R0603]  52.55 52.35 0 top
R37  10kΩ  [R0603]  64.62 52.23 0 top
R38  10kΩ  [R0603]  76.68 52.23 0 top
R39  10kΩ  [R0603]  88.11 52.35 0 top
R40  10kΩ  [R0603]  52.68 40.8 0 top
R41  10kΩ  [R0603]  64.75 40.8 0 top
R42  10kΩ  [R0603]  76.68 41.05 0 top
R43  10kΩ  [R0603]  88.24 40.54 0 top
R44  10kΩ  [R0603]  52.55 29.11 0 top
R45  10kΩ  [R0603]  64.75 29.11 0 top
R46  10kΩ  [R0603]  88.49 29.49 0 top
SW1  TC-6610-9-260G  [SW-TH_4P-L5.0-W5.0-P4.50-LS6.5]  51.05 58.55 0 top
SW2  TC-6610-9-260G  [SW-TH_4P-L5.0-W5.0-P4.50-LS6.5]  62.78 58.55 0 top
SW3  TC-6610-9-260G  [SW-TH_4P-L5.0-W5.0-P4.50-LS6.5]  74.5 58.55 0 top
SW4  TC-6610-9-260G  [SW-TH_4P-L5.0-W5.0-P4.50-LS6.5]  86.23 58.55 0 top
SW5  TC-6610-9-260G  [SW-TH_4P-L5.0-W5.0-P4.50-LS6.5]  50.93 47.42 0 top
SW6  TC-6610-9-260G  [SW-TH_4P-L5.0-W5.0-P4.50-LS6.5]  62.99 47.3 0 top
SW7  TC-6610-9-260G  [SW-TH_4P-L5.0-W5.0-P4.50-LS6.5]  75.06 47.3 0 top
SW8  TC-6610-9-260G  [SW-TH_4P-L5.0-W5.0-P4.50-LS6.5]  86.49 47.42 0 top
SW9  TC-6610-9-260G  [SW-TH_4P-L5.0-W5.0-P4.50-LS6.5]  51.05 35.87 0 top
SW10  TC-6610-9-260G  [SW-TH_4P-L5.0-W5.0-P4.50-LS6.5]  63.12 35.87 0 top
SW11  TC-6610-9-260G  [SW-TH_4P-L5.0-W5.0-P4.50-LS6.5]  75.06 36.12 0 top
SW12  TC-6610-9-260G  [SW-TH_4P-L5.0-W5.0-P4.50-LS6.5]  86.61 35.61 0 top
SW13  TC-6610-9-260G  [SW-TH_4P-L5.0-W5.0-P4.50-LS6.5]  50.93 24.18 0 top
SW14  TC-6610-9-260G  [SW-TH_4P-L5.0-W5.0-P4.50-LS6.5]  63.12 24.18 0 top
SW15  TC-6610-9-260G  [SW-TH_4P-L5.0-W5.0-P4.50-LS6.5]  75.18 24.44 0 top
SW16  TC-6610-9-260G  [SW-TH_4P-L5.0-W5.0-P4.50-LS6.5]  86.87 24.56 0 top
TP12  -  [Test-Point-0.5mm]  69.22 96.92 0 top
TP13  -  [Test-Point-0.5mm]  84.69 72.53 0 top
TP14  -  [Test-Point-0.5mm]  52.71 74.47 0 top
TP15  -  [Test-Point-0.5mm]  70.23 6.53 0 top
TP16  -  [Test-Point-0.5mm]  68.67 0.71 0 top
TP17  -  [Test-Point-0.5mm]  70.91 19.58 0 top
TP18  -  [Test-Point-0.5mm]  40.63 1.07 90 top
TP19  -  [Test-Point-0.5mm]  38.5 1.07 90 top
TP20  -  [Test-Point-0.5mm]  36.38 1.07 90 top
TP21  -  [Test-Point-0.5mm]  34.26 1.07 90 top
TP22  -  [Test-Point-0.5mm]  32.14 1.07 90 top
TP23  -  [Test-Point-0.5mm]  30.02 1.07 90 top
TP24  -  [Test-Point-0.5mm]  27.9 1.07 90 top
TP25  -  [Test-Point-0.5mm]  52.78 1.2 90 top
TP26  -  [Test-Point-0.5mm]  58.05 74.49 0 top
TP27  -  [Test-Point-0.5mm]  74.45 18.8 0 top
TP28  -  [Test-Point-0.5mm]  76.58 72.7 0 top
TP29  -  [Test-Point-0.5mm]  87.5 97.59 0 top
TP30  -  [Test-Point-0.5mm]  47.22 1.08 270 top
TP31  -  [Test-Point-0.5mm]  45.08 1.08 270 top
TP32  -  [Test-Point-0.5mm]  42.94 1.08 270 top
TP33  -  [Test-Point-0.5mm]  93.34 48.14 0 top
U1  PH2.54-01-03PZS  [HDR-TH_6P-P2.54-V-M-R2-C3-S2.54]  96.65 57.2 270 top
U2  PH2.54-01-03PZS  [HDR-TH_6P-P2.54-V-M-R2-C3-S2.54]  3.94 9.96 270 top
U7  TPS5430DDAR  [ESOP-8_L4.9-W3.9-P1.27-LS6.0-TL-EP]  65.81 5.31 0 top
U8  TPS5430DDAR  [ESOP-8_L4.9-W3.9-P1.27-LS6.0-TL-EP]  60.67 86.78 270 top
U9  TPS5430DDAR  [ESOP-8_L4.9-W3.9-P1.27-LS6.0-TL-EP]  77.84 86.35 270 top
U10  HC-PM254-8.5H-2x30PZ  [HDR-TH_60P-P2.54-V-F-R2-C30-S2.54]  3.85 55.73 270 top
U11  HC-PM254-8.5H-2x30PZ  [HDR-TH_60P-P2.54-V-F-R2-C30-S2.54]  41.95 55.73 270 top

## Footprints (pads in the part's own frame, mm; a bottom-side part is the same pattern mirrored in y, then rotated)
C0603
  rect 0.8x0.9 smd: 1(-0.7,0) 2(0.7,0)
C0805
  rect 1.41x1.35 smd: 1(-1,0) 2(1,0)
CONN-TH_XT30PW-M
  round 2.5 hole 1.8: 1(-2.5,5) 2(2.5,5)
  round 1.8 hole 1.1: 3(5.5,-5) 4(-5.5,-5)
ESOP-8_L4.9-W3.9-P1.27-LS6.0-TL-EP
  rect 1.3x0.6 smd: 1(-2.7,1.905) 2(-2.7,0.635) 3(-2.7,-0.635) 4(-2.7,-1.905) 5(2.7,-1.905) 6(2.7,-0.635) 7(2.7,0.635) 8(2.7,1.905)
  rect 2.5x3.5 smd: 9(0,0)
HDR-TH_4P-P2.54-V-M
  rect 1.7x1.7 hole 1.1: 1(-3.81,0)
  round 1.7 hole 1.1: 2(-1.27,0) 3(1.27,0) 4(3.81,0)
HDR-TH_6P-P2.54-V-M
  rect 1.7x1.7 hole 1.1: 1(-6.35,0)
  round 1.7 hole 1.1: 2(-3.81,0) 3(-1.27,0) 4(1.27,0) 5(3.81,0) 6(6.35,0)
HDR-TH_6P-P2.54-V-M-R2-C3-S2.54
  rect 1.7x1.7 hole 1.1: 1(-2.54,-1.27)
  round 1.7 hole 1.1: 2(-2.54,1.27) 3(0,-1.27) 4(0,1.27) 5(2.54,-1.27) 6(2.54,1.27)
HDR-TH_7P-P2.54-V-F
  rect 1.575x1.7 hole 1.1: 1(-7.62,0)
  round 1.7 hole 1.1: 2(-5.08,0) 3(-2.54,0) 4(0,0) 5(2.54,0) 6(5.08,0) 7(7.62,0)
HDR-TH_10P-P2.54-V-M
  rect 1.575x1.7 hole 1.1: 1(-11.43,0)
  round 1.7 hole 1.1: 2(-8.89,0) 3(-6.35,0) 4(-3.81,0) 5(-1.27,0) 6(1.27,0) 7(3.81,0) 8(6.35,0) 9(8.89,0) 10(11.43,0)
HDR-TH_12P-P2.54-V-M-R2-C6-S2.54
  rect 1.7x1.7 hole 1.1: 1(-6.35,-1.27)
  round 1.7 hole 1.1: 2(-6.35,1.27) 3(-3.81,-1.27) 4(-3.81,1.27) 5(-1.27,-1.27) 6(-1.27,1.27) 7(1.27,-1.27) 8(1.27,1.27) 9(3.81,-1.27) 10(3.81,1.27) 11(6.35,-1.27) 12(6.35,1.27)
HDR-TH_60P-P2.54-V-F-R2-C30-S2.54
  rect 1.6x1.6 hole 1: 1(-36.83,-1.27)
  round 1.6 hole 1: 2(-36.83,1.27) 3(-34.29,-1.27) 4(-34.29,1.27) 5(-31.75,-1.27) 6(-31.75,1.27) 7(-29.21,-1.27) 8(-29.21,1.27) 9(-26.67,-1.27) 10(-26.67,1.27) 11(-24.13,-1.27) 12(-24.13,1.27) 13(-21.59,-1.27) 14(-21.59,1.27) 15(-19.05,-1.27) 16(-19.05,1.27) 17(-16.51,-1.27) 18(-16.51,1.27) 19(-13.97,-1.27) 20(-13.97,1.27) 21(-11.43,-1.27) 22(-11.43,1.27) 23(-8.89,-1.27) 24(-8.89,1.27) 25(-6.35,-1.27) 26(-6.35,1.27) 27(-3.81,-1.27) 28(-3.81,1.27) 29(-1.27,-1.27) 30(-1.27,1.27) 31(1.27,-1.27) 32(1.27,1.27) 33(3.81,-1.27) 34(3.81,1.27) 35(6.35,-1.27) 36(6.35,1.27) 37(8.89,-1.27) 38(8.89,1.27) 39(11.43,-1.27) 40(11.43,1.27) 41(13.97,-1.27) 42(13.97,1.27) 43(16.51,-1.27) 44(16.51,1.27) 45(19.05,-1.27) 46(19.05,1.27) 47(21.59,-1.27) 48(21.59,1.27) 49(24.13,-1.27) 50(24.13,1.27) 51(26.67,-1.27) 52(26.67,1.27) 53(29.21,-1.27) 54(29.21,1.27) 55(31.75,-1.27) 56(31.75,1.27) 57(34.29,-1.27) 58(34.29,1.27) 59(36.83,-1.27) 60(36.83,1.27)
IND-SMD_L4.0-W4.0
  rect 1.6x3.5 smd: 1(-1.6,0) 2(1.6,0)
IND-SMD_L5.2-W5.2_YSPI0530
  rect 1.8x2.5 smd: 1(-2.4,0) 2(2.4,0)
R0603
  rect 0.806x0.864 smd: 1(-0.753,0) 2(0.753,0)
SMA_L4.3-W2.6-LS5.2-RD
  rect 2x2 smd: 1(-2.2,0) 2(2.2,0)
SW-TH_4P-L5.0-W5.0-P4.50-LS6.5
  round 1.8 hole 1.2: 1(-3.25,2.25) 2(3.25,2.25) 3(-3.25,-2.25) 4(3.25,-2.25)
Test-Point-0.5mm
  round 0.5 smd: 1(0,0)

## Nets
As in the schematic.

Pads without a net: CN1 3 4; CN2 3 4; SW1 2 3; SW2 2 3; SW3 2 3; SW4 2 3; SW5 2 3; SW6 2 3; SW7 2 3; SW8 2 3; SW9 2 3; SW10 2 3; SW11 2 3; SW12 2 3; SW13 2 3; SW14 2 3; SW15 2 3; SW16 2 3; U7 2 3 5; U8 2 3 5; U9 2 3 5; U10 6 16 29 31 32 33 34 35 41 43 49 50 51 52 53 54 55 56 57 58 59 60; U11 5 6 14 15 16 17 18 20 21 24 26 27 28 30 31 33 37 38 45 47 50 53 54 55 56 57 58 59 60

## Via types
v1: diameter 0.61, hole 0.305, Top Layer to Bottom Layer, 72 vias

## Routing (per net, layer and track width the routed paths; a pad name or vN(x,y) marks a point on that pad's centre or on a via; arc(x,y) is an arc through that point)
3V3: length 450.6
  Top Layer w0.254: 11.49,10.66 11.49,10.53 13.46,8.56 27.18,8.56 27.63,8.1 45.26,8.1 ; 11.49,10.66 11.43,10.72 11.43,85.78 v1(11.81,86.16) ; 11.49,10.66 9.02,8.18 9.02,4.37 11.18,2.21 11.3,2.21 ; 11.49,10.66 11.56,10.72 ; 45.26,8.1 H21.8 ; 45.26,8.1 50.34,8.1 H21.10 52.78,6.07 TP25.1 ; 5.39,92.56 10.62,92.56 v1(11.81,91.36) ; 5.39,92.56 H4.1 9.91,96.32 12.58,93.64 45.47,93.64 45.72,93.38 45.72,67.23 48.01,64.95 52.96,64.95 53.59,64.31 53.59,63.64 R32.2 ; 5.39,92.56 U10.2 U10.1 ; R44.2 54.67,30.48 55.88,30.48 56.06,30.66 56.06,39.11 55.88,39.29 54.94,39.29 R40.2 53.44,40.8 54.36,41.71 55.37,41.71 55.88,42.22 55.88,49.78 R36.2 56.13,55.18 56.13,61.9 55.55,62.48 54.41,62.48 54.23,62.66 54.23,62.68 R32.2 ; R46.2 89.39,29.49 91.69,31.8 91.69,38.66 91.24,39.11 89.46,39.11 89.28,39.29 89.28,40.26 R43.2 90.79,42.34 91.69,42.34 91.69,50.09 90.86,50.93 89.33,50.93 89.15,51.11 89.15,52.07 R39.2 88.87,52.72 91.49,55.35 91.49,61.85 91.31,62.03 89.28,62.03 88.61,62.7 R35.2 88.52,63.57 88.52,64.82 88.26,65.08 82.17,65.08 80.57,63.48 R34.2 ; R34.2 76.88,62.74 77.6,62.03 79.76,62.03 79.94,61.85 79.94,54.08 79.12,53.26 78.47,53.26 R38.2 78.69,50.98 80.01,50.98 80.19,50.8 80.19,42.98 79.43,42.22 78.6,42.22 R42.2 77.72,40.76 77.72,39.8 77.9,39.62 79.43,39.62 80.26,38.79 80.26,30.15 79.5,29.39 77.59,29.39 R31.2 ; R34.2 76.76,63.6 76.76,64.77 76.58,64.95 70.1,64.95 68.63,63.48 R33.2 ; R32.2 57.46,63.48 59.06,65.08 64.64,65.08 65.16,64.56 R33.2 ; R33.2 65.16,62.66 65.53,62.28 67.56,62.28 67.74,62.1 67.74,54.6 R37.2 65.37,51.39 65.91,50.85 67.82,50.85 68,50.67 68,42.34 67.82,42.16 66.87,42.16 R41.2 65.5,39.84 65.79,39.55 68.07,39.55 68.25,39.37 68.25,30.96 66.4,29.11 R45.2
  Bottom Layer w0.254: v1(11.81,91.36) v1(11.81,86.16)
5V: length 215.3
  Top Layer w0.508: TP33.1 93.39,48.18 H24.10 ; 64.9,16.18 64.9,13.23 R25.1 ; 64.9,16.18 62.74,18.34 59.31,18.34 58.23,17.26 58.23,8.75 C40.1 58.4,8.41 57.15,7.16 54.61,7.16 54.1,7.67 54.1,15.8 53.97,15.94 53.15,15.94 ; 64.9,16.18 68.3,19.58 TP17.1 73.67,19.58 TP27.1 ; H24.10 H24.8 H24.6 H24.4 H24.2 H8.12 H8.10 H8.8 H8.6 H8.4 H8.2 91.4,18.8 TP27.1 ; H24.10 H24.12 ; L3.2 74.45,16.45 TP27.1
  Top Layer w0.762: 53.15,15.94 38.47,15.94 22.99,31.42 22.99,87.05 20.07,89.97 2.64,89.97 U10.3
5V_SAMPLE: length 71.7
  Top Layer w0.508: TP28.1 77.47,71.81 H16.8 ; H16.2 H16.4 H16.6 H16.8 ; H16.8 H16.10 H16.12 89.15,69.65 90.89,71.38 C62.1 91.21,78.09 C57.1 90.59,96.56 L6.2 74.66,96.56 73.63,95.52 R29.1
6.5V: length 68.3
  Top Layer w0.508: TP26.1 58.05,69.91 H15.8 ; L5.2 58.31,95.7 R27.1 55.11,93.15 52.07,96.19 48.64,96.19 47.75,95.3 47.75,74.99 C51.1 48.01,73.58 50.16,71.43 H15.2 H15.4 H15.6 H15.8 ; TP14.1 52.71,69.9 ; H15.8 H15.10 H15.12
12V: length 25.4
  Top Layer w0.508: CN1.2 84.96,12.25 84.96,7.74 C27.2 C30.2 C32.2 72.28,6.58 70.29,6.58 ; U7.7 69.65,5.94 TP15.1
12V_SAMPLE: length 60.3
  Top Layer w0.254: C52.2 74.13,77.14
  Top Layer w0.508: CN2.2 84.69,72.53 TP13.1 83.54,73.68 C56.2 C54.2 C55.2 C52.2 74.27,75.33 73.03,74.09 68.96,74.09 67.88,75.17 67.88,77.39 66.78,78.49 C44.2 ; C44.2 C41.2 ; C44.2 60.07,80.95 ; 60.07,80.95 61.31,82.19 U8.7 ; U9.7 78.47,81.82 77.6,80.95 73.41,80.95 72.01,79.55 72.01,77.78 72.64,77.14 74.13,77.14
ADC1_INP2: length 92.4
  Top Layer w0.254: 42.87,5.69 42.87,3.32 TP18.1
  Inner1 w0.254: U10.28 v1(34.54,59.54)
  Bottom Layer w0.254: 42.87,5.69 42.87,6.76 41.66,7.98 41.66,11.18 36.88,15.95 36.88,57.46 34.8,59.54 v1(34.54,59.54)
ADC1_INP3: length 97.7
  Top Layer w0.254: TP19.1 40.33,2.9 40.33,5.69
  Bottom Layer w0.254: 40.33,5.69 40.46,5.56 40.46,3.38 40.21,3.13 28.12,3.13 26.54,4.7 26.54,44.5 6.33,64.71 6.33,65.07 5.32,66.08 4.68,66.08 4.05,66.71 4.05,67.76 2.71,69.09 2.71,69.57 U10.19
ADC1_INP4: length 123.2
  Top Layer w0.254: 37.79,5.69 37.79,2.48 TP20.1
  Bottom Layer w0.254: U10.21 2.84,67.16 2.9,67.22 2.9,67.58 1.51,68.97 1.51,83.47 1.89,83.86 3.29,83.86 3.92,84.49 3.92,85.5 4.43,86.02 6.23,86.02 29.46,62.79 29.46,21.83 39.12,12.18 39.12,7.04 37.79,5.71
ADC1_INP5: length 85.1
  Top Layer w0.254: v1(34.04,2.34) 34.04,4.47 35.25,5.69 35.25,2.06 TP21.1
  Bottom Layer w0.254: U10.26 5.63,62.08 25.78,41.93 25.78,4.24 28.27,1.75 33.45,1.75 v1(34.04,2.34)
ADC1_INP6: length 85
  Top Layer w0.254: v1(31.12,1.07) 31.12,4.09 32.71,5.69 32.71,1.64 TP22.1
  Bottom Layer w0.254: U10.27 3.91,58.22 8.99,58.22 25.4,41.81 25.4,4.12 28.45,1.07 v1(31.12,1.07)
ADC1_INP8: length 122.4
  Top Layer w0.254: H23.1 50.55,4.41 TP30.1
  Bottom Layer w0.254: H23.1 45.26,0.48 8,0.48 1.51,6.98 1.51,65.07 2.14,65.7 4.05,65.7 U10.24
ADC1_INP9: length 83.1
  Top Layer w0.254: v1(28.96,2.34) 28.96,4.47 30.17,5.69 30.17,1.22 TP23.1
  Bottom Layer w0.254: U10.23 3.6,64.62 4.68,63.54 5.19,63.54 18.21,50.52 18.21,50.01 26.16,42.06 26.16,4.37 28.19,2.34 v1(28.96,2.34)
ADC1_INP10: length 94.6
  Top Layer w0.254: TP24.1 27.63,1.34 27.63,5.69
  Bottom Layer w0.254: U10.8 28.83,61.23 28.83,21.71 28.5,21.38 28.5,20.89 28.83,20.56 28.83,6.89 27.63,5.69
ADC1_INP16: length 110.8
  Top Layer w0.254: TP31.1 48.01,4.01 H23.2
  Inner2 w0.254: v1(28.19,12.88) 28.74,12.33 46.61,12.33 46.86,12.08 46.86,7.04 48.01,5.89 H23.2
  Bottom Layer w0.254: v1(28.19,12.88) 28.19,20.69 28.14,20.74 28.14,21.52 28.19,21.57 28.19,59.33 U10.10
ADC1_INP17: length 110.8
  Top Layer w0.254: H23.3 45.47,3.62 TP32.1
  Inner2 w0.254: H23.3 44.07,7.16 44.07,11.72 43.81,11.98 27.63,11.98 v1(27.3,12.3)
  Bottom Layer w0.254: U10.9 4.03,80.95 5.46,80.95 5.47,80.94 5.57,80.94 27.71,58.8 27.71,15.56 27.3,15.15 v1(27.3,12.3)
DC: length 79.4
  Top Layer w0.254: v1(45.97,17.7) 45.21,18.47 45.21,54.28 44.96,54.53 43.3,54.53 U11.32
  Inner2 w0.254: 21.46,2.21 22.73,0.94 25.27,0.94 25.71,1.37 25.71,12.68 27.69,14.66 v1(45.97,14.66)
  Bottom Layer w0.254: v1(45.97,14.66) v1(45.97,17.7)
PA2: length 28.5
  Inner2 w0.254: U10.11 2.97,79.86 4.32,81.2 13.84,81.2 15.37,82.73 15.37,96.7 H4.3
PA3: length 39.1
  Inner2 w0.254: U10.20 16.31,69.7 17.53,70.92 H4.4
PA4: length 89.7
  Top Layer w0.254: v1(76.2,61.65) 75.38,62.47 75.38,63.48 73.32,63.48 C66.2 73.3,62.84 SW3.1
  Inner1 w0.254: v1(76.2,61.65) 76.2,64.19 75.95,64.44 47.12,64.44 46.23,65.33 46.23,69.39 44.58,71.04 3.78,71.04 U10.17
PA5: length 64
  Top Layer w0.254: v1(2.54,16.05) 2.54,12.62 U2.1
  Inner2 w0.254: v1(2.54,16.05) 1.65,16.05 1.22,16.49 1.22,70.86 1.4,71.04 3.93,71.04 U10.18
PA7: length 95.5
  Inner2 w0.254: U10.22 31.38,67.16 38.43,60.11 38.43,59.92 40,58.34 55.63,58.34 56.77,57.2 58.42,57.2 59.56,58.34 93.98,58.34 U1.1
PA15: length 37.2
  Inner2 w0.254: 24.26,10.85 24.26,20.25 29.7,25.7 29.7,25.87 30.04,26.22 30.22,26.22 39.61,35.6 41.13,35.6 41.76,36.23 41.76,37.76 U11.44
PB2: length 62.6
  Top Layer w0.254: v1(45.65,62.79) 47.64,60.8 SW1.1 48.94,60.8 49.85,61.71 C64.2 49.87,63.48 R32.1
  Inner1 w0.254: v1(45.65,62.79) 45.65,68.32 45.47,68.5 39.12,68.5 37.85,69.77 26.8,69.77 18.03,61.01 5.58,61.01 5.57,61 3.66,61 U10.25
PB5: length 52.8
  Top Layer w0.254: R35.1 85.04,63.48 C67.2 85.02,62.84 SW4.1 81.54,59.36 v1(81.15,59.36) ; v1(45.72,60.12) 45.09,60.76 v1(39.12,60.76)
  Inner1 w0.254: U11.25 39.36,60.76 v1(39.12,60.76) ; v1(81.15,59.36) 80.9,59.61 79.12,59.61 79.12,59.62 47.32,59.62 46.81,60.12 v1(45.72,60.12)
PB7: length 29.6
  Top Layer w0.254: 49.74,52.35 C68.2 49.72,50.92 48.48,49.67 SW5.1 ; 49.74,52.35 R36.1 ; 49.74,52.35 49.78,52.39 49.78,53.39 49.15,54.03 v1(47.88,54.03) ; v1(38.74,55.68) 38.74,57.71 37.85,58.6 v1(37.85,59.87)
  Inner1 w0.254: v1(37.85,59.87) 37.85,61.78 U11.23 ; v1(47.88,54.03) 46.23,55.68 v1(38.74,55.68)
PB8: length 50.3
  Top Layer w0.254: R37.1 61.81,52.23 61.79,52.25 61.79,51.59 SW6.1 58.56,50.72 v1(57.4,50.72) ; v1(38.74,70.03) 37.59,68.89 v1(37.59,65.33)
  Inner1 w0.254: v1(57.4,50.72) 57.15,50.98 46.86,50.98 46.61,50.72 38.1,50.72 37.26,51.56 37.26,65 v1(37.59,65.33) ; U11.19 39.19,69.7 38.86,70.03 v1(38.74,70.03)
PB9: length 48.3
  Top Layer w0.254: v1(70.1,51.99) 70.1,51.25 SW7.1 73.85,51.59 C70.2 73.87,52.23 R38.1
  Inner1 w0.254: v1(70.1,51.99) 70.1,55.78 70.07,55.81 70.07,56.6 67.74,58.93 45.14,58.93 44.96,59.11 44.96,65.43 U11.22
PB10: length 99.7
  Top Layer w0.254: R39.1 85.3,52.35 C71.2 85.28,51.72 SW8.1 81.79,48.22 v1(81.79,47.68)
  Inner1 w0.254: U10.44 35.89,39.22 39.5,35.61 40.23,35.61 40.24,35.6 43.67,35.6 43.68,35.61 43.69,35.61 46.99,32.31 49.02,32.31 52.07,35.36 78.99,35.36 81.79,38.15 v1(81.79,47.68)
PB11: length 55.3
  Top Layer w0.254: R40.1 49.87,40.8 ; 49.87,40.8 49.91,40.76 49.91,39.42 48.6,38.12 SW9.1 48.13,37.79 48.13,35.87 47.5,35.23 v1(46.61,35.23) ; 49.87,40.8 C72.2
  Inner1 w0.254: v1(46.61,35.23) 46.61,36.63 45.21,38.02 39.37,38.02 35.63,41.76 U10.42
PB12: length 64
  Inner2 w0.254: 24,2.21 22.99,3.23 22.99,13.89 20.63,16.25 20.63,41.15 19.81,41.96 17.91,41.96 17.27,41.33 17.27,37.77 14.86,35.36 4.32,35.36 3.1,34.14 U10.47
PB13: length 43.9
  Inner1 w0.254: 13.84,2.21 12.32,0.69 7.62,0.69 7.11,1.19 7.11,34.69 U10.46
PB14: length 29.6
  Inner1 w0.254: U10.45 0.51,34.6 0.51,10.59 1.46,9.64 2.35,9.64 U2.3
PB15: length 29.2
  Inner1 w0.254: U2.5 3.94,8.69 3.94,14.53 6.73,17.32 6.73,32.69 5.28,34.14 U10.48
PC1: length 96.7
  Inner2 w0.254: 16.15,2.21 13.23,5.13 1.4,5.13 0.86,5.67 0.86,82.2 2.58,83.93 U10.7
PC6: length 42.3
  Top Layer w0.254: v1(24,22.91) 18.29,22.91 v1(18.03,22.66)
  Inner1 w0.254: v1(24,22.91) 30.15,29.06 U11.51
  Inner2 w0.254: U2.2 15.37,22.66 v1(18.03,22.66)
PC7: length 47.6
  Top Layer w0.254: v1(27.13,15.8) v1(16.51,15.8)
  Inner2 w0.254: U2.4 11.05,15.8 v1(16.51,15.8) ; U11.52 41.76,27.6 40.24,27.6 39.61,26.97 39.61,26.07 40,25.67 40,25.13 39.61,24.74 38.91,24.74 29.96,15.8 v1(27.13,15.8)
PC8: length 50.4
  Top Layer w0.254: v1(24.13,24.94) 24,24.82 v1(17.91,24.82)
  Inner1 w0.254: U11.49 30.79,31.6 v1(24.13,24.94)
  Inner2 w0.254: U2.6 4.06,8.56 4.06,12.98 15.9,24.82 v1(17.91,24.82)
PC11: length 28.4
  Top Layer w0.254: R41.1 61.94,40.8 C73.2 61.91,40.16 SW10.1 58.17,36.41 v1(58.17,34.47)
  Inner1 w0.254: U11.48 46.2,31.17 56.39,31.17 58.17,32.94 v1(58.17,34.47)
PC13: length 87
  Top Layer w0.254: v1(36.32,72.06) v1(36.32,68.38) ; SW11.1 74.04,40.6 74.04,40.88 C74.2 75.91,41.07 R42.1
  Inner1 w0.254: v1(36.32,72.06) 36.32,80.58 U11.7 ; v1(36.32,68.38) 36.45,68.25 36.45,42.72 38.74,40.44 46.74,40.44 47.5,39.68 67.56,39.68 68.71,38.53 71.26,38.53 71.43,38.37 SW11.1
PD0: length 52.7
  Top Layer w0.254: v1(81.15,40.31) 81.66,40.82 82.3,40.82 83.36,39.75 SW12.1 85.41,39.91 C75.2 85.43,40.54 R43.1
  Inner1 w0.254: U11.46 44.14,36.68 46.48,34.34 46.74,34.34 47.5,35.1 50.93,35.1 52.07,36.25 78.74,36.25 81.15,38.66 v1(81.15,40.31)
PD1: length 33.1
  Top Layer w0.254: R44.1 49.74,29.11 C76.2 49.72,27.55 48.6,26.43 SW13.1 47.75,26.36 v1(47.75,24.18) ; v1(39.37,25.32) 39.37,39.17 v1(39.12,39.42)
  Inner1 w0.254: U11.43 40.48,39.42 v1(39.12,39.42) ; v1(39.37,25.32) 45.34,25.32 46.23,26.21 47.46,26.21 SW13.1
PD2: length 35.3
  Top Layer w0.254: SW14.1 61.91,28.48 C77.2 61.94,29.11 R45.1 ; v1(57.4,40.26) v1(57.4,30.4)
  Inner1 w0.254: U11.42 55.9,41.76 v1(57.4,40.26) ; v1(57.4,30.4) 57.4,28.9 SW14.1
PD3: length 64
  Top Layer w0.254: R31.1 74,29.37 73.98,29.39 73.98,28.73 SW15.1 71.93,25.5 v1(70.49,24.05) ; v1(38.35,41.83) v1(38.35,25.2)
  Inner1 w0.254: U11.39 38.35,41.97 v1(38.35,41.83) ; v1(70.49,24.05) 69.22,22.78 67.18,22.78 66.86,23.11 47.19,23.11 46.86,22.78 38.86,22.78 38.35,23.29 v1(38.35,25.2)
PD4: length 63.8
  Top Layer w0.254: v1(81.15,41.71) v1(82.68,41.71) ; SW16.1 85.66,28.86 85.66,29.52 85.69,29.49 R46.1
  Inner1 w0.254: SW16.1 82.8,27.63 82.8,30.4 83.26,30.86 84.53,30.86 84.71,31.04 84.71,39.68 v1(82.68,41.71) ; v1(81.15,41.71) 80.14,42.72 45.85,42.72 44.27,44.3 U11.40
PD7: length 49.6
  Top Layer w0.254: v1(34.93,48.47) v1(34.93,38.15)
  Inner1 w0.254: 21.59,10.72 21.59,10.97 22.99,12.37 22.99,26.47 34.09,37.57 34.41,37.57 34.75,37.91 34.75,37.97 v1(34.93,38.15)
  Inner2 w0.254: v1(34.93,48.47) 35.83,49.38 U11.35
PE9: length 103.4
  Top Layer w0.254: U1.2 97.92,61.77 97.41,62.28 94.23,62.28 92.84,60.88 v1(92.84,56.69)
  Inner2 w0.254: U10.36 33.58,49.38 39.88,55.68 45.85,55.68 46.48,55.04 91.19,55.04 v1(92.84,56.69)
PE10: length 100.6
  Inner2 w0.254: U10.37 3.38,46.84 4.57,45.64 45.09,45.64 46.61,47.17 81.47,47.17 81.55,47.09 82.03,47.09 82.11,47.17 89.4,47.17 92.96,50.73 92.96,54.92 95.25,57.2 U1.3
PE11: length 101.8
  Top Layer w0.254: U1.4 99.31,55.8 99.31,53.9 97.41,51.99 v1(92.38,51.99)
  Inner2 w0.254: U10.38 37.26,46.84 38.74,48.31 40.23,48.31 40.24,48.3 43.67,48.3 43.68,48.31 90.04,48.31 92.38,50.65 v1(92.38,51.99)
PE12: length 101.3
  Inner2 w0.254: U10.39 3.78,43.1 84.46,43.1 85.34,43.99 90.23,43.99 90.92,44.68 90.92,45.5 93.32,47.91 93.32,52.6 U1.5
PE13: length 100
  Inner1 w0.254: v1(37.67,44.43) 39.01,45.77 40.23,45.77 40.24,45.76 43.67,45.76 43.68,45.77 45.47,45.77 46.99,47.3 78.23,47.3 82.8,51.87 82.8,53.77 83.44,54.41 92.33,54.41 94.49,52.25 95.5,52.25 U1.6
  Inner2 w0.254: U10.40 5.25,44.43 v1(37.67,44.43)
PF0: length 105.2
  Top Layer w0.254: v1(28.96,68.12) 30.28,66.8 v1(30.28,25.63)
  Inner1 w0.254: v1(30.28,25.63) 25.27,20.62 25.27,9.7 25.09,9.52 12.27,9.52 11.43,8.69 H17.1
  Inner2 w0.254: v1(28.96,68.12) 28.96,79.3 33.4,83.74 42.03,83.74 U11.8
PF1: length 98.4
  Top Layer w0.254: v1(30.23,68.12) 30.92,67.43 v1(30.92,25.19)
  Inner1 w0.254: v1(30.92,25.19) 25.63,19.9 25.63,9.56 25.24,9.17 13.97,9.17 13.79,8.99 13.79,6.71 H17.2
  Inner2 w0.254: U11.9 33.58,82.4 30.23,79.05 v1(30.23,68.12)
PF2: length 97
  Top Layer w0.254: v1(31.62,24.82) 31.62,67.87 v1(31.37,68.12)
  Inner1 w0.254: v1(31.62,24.82) 25.98,19.18 25.98,9.41 25.39,8.81 17.02,8.81 16.51,8.3 H17.3
  Inner2 w0.254: U11.10 42.03,81.2 33.66,81.2 31.37,78.92 v1(31.37,68.12)
PF3: length 91.5
  Top Layer w0.254: v1(32.89,23.93) 32.89,67.49 v1(33.27,67.87)
  Inner1 w0.254: v1(32.89,23.93) 26.34,17.38 26.34,9.26 25.54,8.46 20.07,8.46 19.05,7.44 H17.4
  Inner2 w0.254: U11.12 42.15,78.78 40.24,78.78 40.23,78.79 33.78,78.79 33.27,78.28 v1(33.27,67.87)
PF4: length 90.5
  Top Layer w0.254: v1(29.08,21.13) 29.97,20.24 v1(29.97,19.99) ; v1(32.23,24.34) 32.23,67.84 v1(32.38,68)
  Inner1 w0.254: v1(29.97,19.99) 29.97,19.61 29.1,18.73 29.1,7.69 28.59,7.18 26.78,7.18 26.24,7.72 22.61,7.72 21.59,6.7 H17.5 ; v1(29.08,21.13) 29.08,21.2 v1(32.23,24.34)
  Inner2 w0.254: U11.11 33.45,79.86 32.38,78.79 v1(32.38,68)
PF13: length 62.2
  Top Layer w0.254: v1(57.28,58.34) 59.53,60.6 SW2.1 60.24,60.8 61.57,62.13 C65.2 61.59,63.48 R33.1 ; v1(34.29,57) 37.79,57 v1(37.85,56.95)
  Inner1 w0.254: U10.30 v1(34.29,57) ; v1(57.28,58.34) 39.24,58.34 v1(37.85,56.95)
PG9: length 52.2
  Top Layer w0.254: v1(35.69,38.15) 35.69,48.06 35.94,48.31 v1(37.47,48.31)
  Inner1 w0.254: U11.36 42.15,48.3 40.24,48.3 40.23,48.31 v1(37.47,48.31) ; v1(24,26.47) 35.1,37.57 35.17,37.57 35.51,37.91 35.51,37.97 v1(35.69,38.15)
  Bottom Layer w0.254: v1(24,26.47) 19.18,21.64 19.18,10.85
PG11: length 55.6
  Top Layer w0.254: v1(34.16,48.57) v1(34.16,38.15)
  Inner1 w0.254: v1(34.16,38.15) 18.62,22.61 18.62,17.08 16.51,14.97 16.51,10.72
  Inner2 w0.254: U11.34 41.9,50.6 36.19,50.6 v1(34.16,48.57)
PG14: length 74.1
  Top Layer w0.254: v1(18.8,50.98) 18.67,50.85 v1(18.67,40.56)
  Inner2 w0.254: v1(18.8,50.98) 34.66,50.98 38.15,54.47 38.15,55.92 38.49,56.26 39.95,56.26 U11.29 ; 18.25,2.63 17.92,2.96 17.92,21.72 18.62,22.42 18.62,22.9 18.54,22.98 18.54,40.44 v1(18.67,40.56)
$1N5567: length 16.6
  Top Layer w0.254: D4.1 75.02,10.72 L3.1 68.65,10.72 C28.1 68.52,7.22 U7.8
$1N5568: length 6
  Top Layer w0.254: C28.2 67.12,9.64 66.29,8.81 64.71,8.81 U7.1
$1N5569: length 11.6
  Top Layer w0.254: U7.4 62.43,3.4 61.85,3.99 61.85,9.45 62.99,10.59 R26.1 63.44,10.65 R25.2
$2N774: length 4.5
  Top Layer w0.254: U9.1 79.84,88.95 81.66,88.95 82.52,88.09 C53.2
$2N775: length 17.5
  Top Layer w0.254: D6.1 87.1,85.55 85.83,86.82 C53.1 ; L6.1 82.3,90.98 83.92,89.36 C53.1 ; C53.1 83.92,85.67 81.9,83.65 U9.8
$2N778: length 7.8
  Top Layer w0.254: U9.4 74.4,89.05 73.26,87.91 R30.1
  Top Layer w0.508: R29.2 75.56,90.46 75.93,90.09 U9.4
$2N2986: length 18
  Top Layer w0.254: D5.1 69.6,86.03 68.9,86.73 C42.1 ; U8.8 65.87,84.08 66.93,85.14 C42.1 ; C42.1 66.93,89.33 64.5,91.76 L5.1
$2N2987: length 5.4
  Top Layer w0.254: U8.1 65,89.48 65.53,88.95 C42.2
$2N2990: length 8.9
  Top Layer w0.254: R27.2 55.85,91.75 58.42,91.75 58.93,91.24 58.93,89.64 U8.4 57.69,89.48 R28.1

## Copper pours and planes (outline as drawn; the poured copper is in the pictures)
GND on Top Layer: -4.83,109.02 107.31,109.02 107.31,-2.23 -4.83,-2.23
GND on Bottom Layer: -11.18,111.94 109.85,111.94 109.85,-17.73 -11.18,-17.73
GND on Inner1: -7.62,105.46 100.97,105.46 100.97,-7.82 -7.62,-7.82
GND on Inner2: -6.22,104.95 105.03,104.95 105.03,-8.46 -6.22,-8.46
PGND on Top Layer: 46.48,98.35 95.43,98.35 95.43,64.95 46.48,64.95
PGND on Inner1: 46.35,98.35 95.5,98.35 95.5,64.82 46.35,64.82
PGND on Inner2: 46.48,98.35 95.52,98.35 95.52,64.95 46.48,64.95

## Text on the board
Top Silkscreen Layer: SPI1 | 3v3 | PF0 | 3V3 | GND | PF1 | TX | SCK | PF2 | RX | MISO | PF3 | MOSI | PF4 | CS | 5V | T83N | SPI2 | RES | DC | ADC1 | P10 | P9 | P6 | P5 | P4 | P3 | P2 | P17 | PGND | 6.5V | P16 | P8 | 12V | T81N | T82N | 1 | 2 | 3 | 1N | 2N | 3N | TIM1
